# Altium project BLDC MOTOR CONTROLLER.PrjPcb
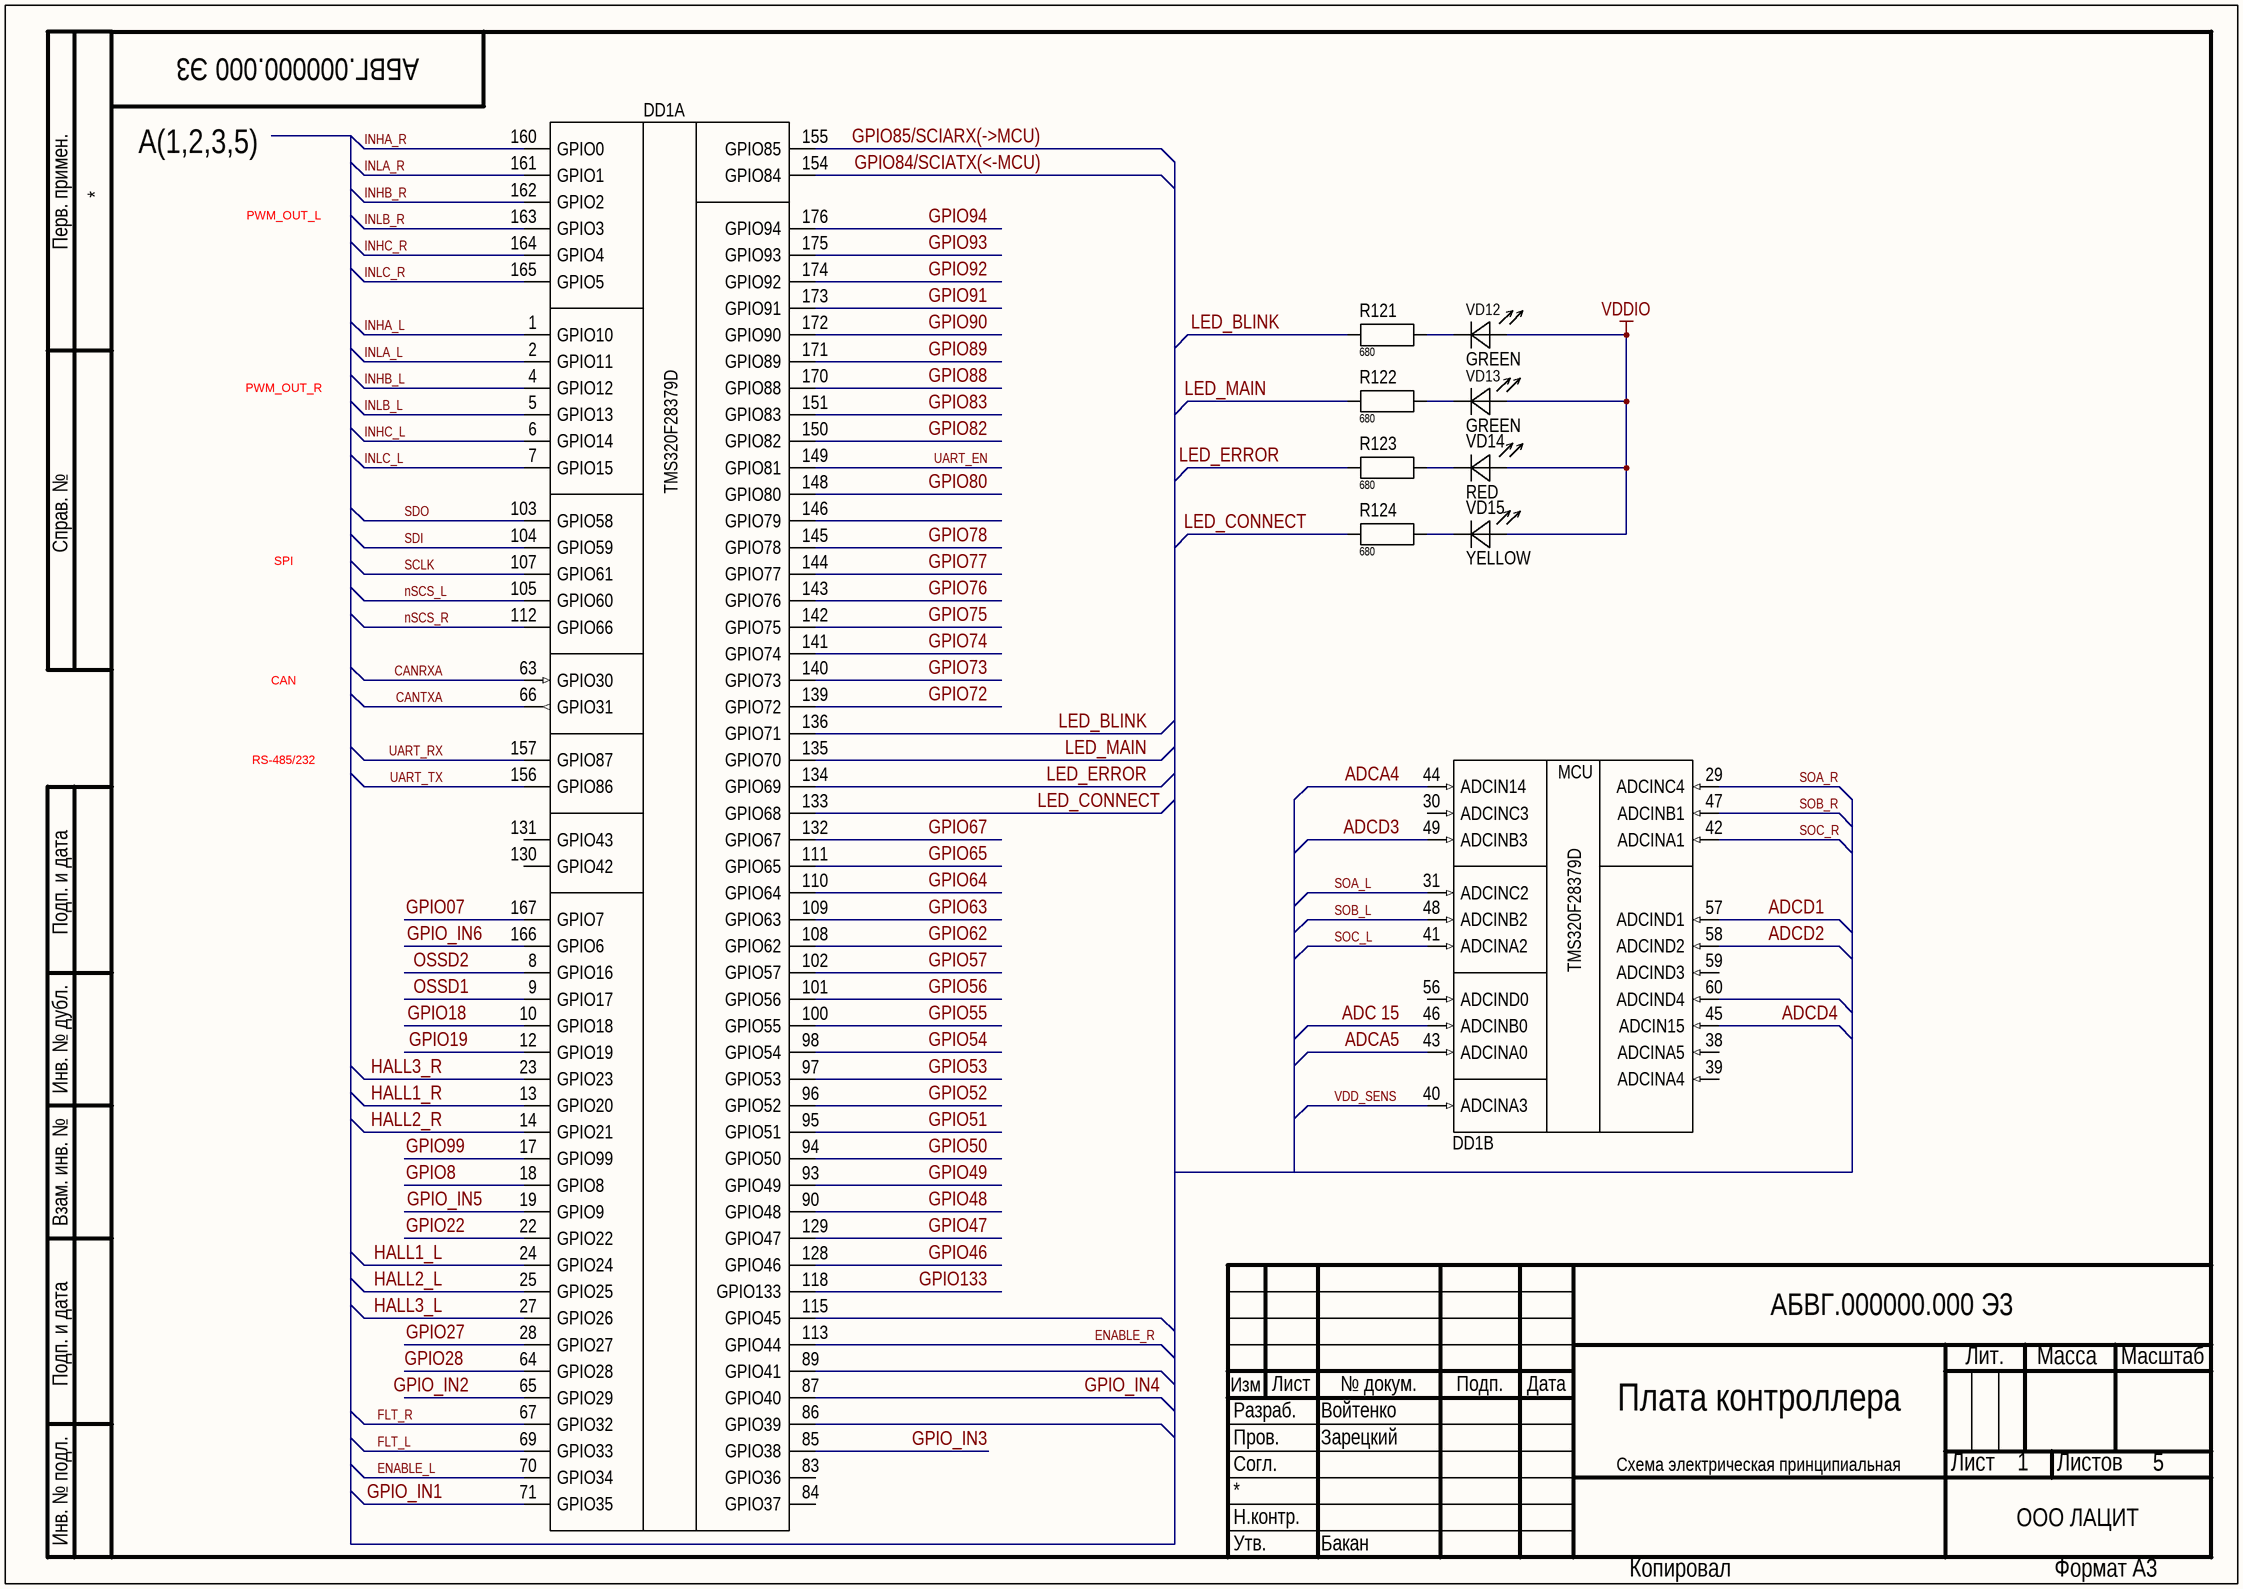
[diagram p0: BLDC-CONTROLLET.SchDoc]
6 sheets, 345 parts. Net scope: global (net labels, ports and power ports of the same name join across sheets).
Board file: BLDC MOTOR CONTROLLER.PcbDoc
Sheets:
  BLDC-CONTROLLET.SchDoc
  BLDC-DRIVER.SchDoc
  BLDC-MOSFET.SchDoc
  BLDC-PWR-CONROLLER.SchDoc
  BLDC-CONNECTORS.SchDoc
  BLDC-FTDI.SchDoc

## Sheet BLDC-CONTROLLET.SchDoc
size 420 x 297 mm; ApprovedBy: Бакан; CheckedBy: Зарецкий; DrawnBy: Войтенко; DocumentNumber: АБВГ.000000.000 Э3; SheetNumber: 1; SheetTotal: 5; PageSetup: Record=PageOptions|CenterHorizontal=False|CenterVertical=False|PrintScale=0.95|XCorrection=0.00|YCorrection=0.00|PrintKind=1|BorderSize=5000000|LeftOffset=0|BottomOffset=0|Orientation=1|PaperLength=1000|PaperWidth=1000|Scale=100|PaperSource=15|PrintQuality=600|MediaType=1|DitherType=10|PaperKind=A4|PrintScaleMode=1; DocumentType: Схема электрическая принципиальная; Developer1size1str: ООО ЛАЦИТ; Title1size1str: Плата контроллера

### Parts
DD1  TMS320F28379DPTP_LACID  [176-HLQFP]  (value not drawn)  (parts A,B of 3)
R121  680  [RES: 0402]
R122  680  [RES: 0402]
R123  680  [RES: 0402]
R124  680  [RES: 0402]
VD12  value GREEN  [LED: 0402G]  (hidden comment: Led 0402 GREEN)
VD13  value GREEN  [LED: 0402G]  (hidden comment: Led 0402 GREEN)
VD14  value RED  [LED: 0402R]  (hidden comment: Led 0402 RED)
VD15  value YELLOW  [LED: 0402Y]  (hidden comment: Led 0402 YELLOW)

### Nets
VDDIO: VD12.1 VD13.1 VD14.1 VD15.1
ADC 15: DD1.46(ADCINB0)
ADCA4: DD1.44(ADCIN14)
ADCA5: DD1.43(ADCINA0)
ADCD1: DD1.57(ADCIND1)
ADCD2: DD1.58(ADCIND2)
ADCD3: DD1.49(ADCINB3)
ADCD4: DD1.45(ADCIN15)
CANRXA: DD1.63(GPIO30)
CANTXA: DD1.66(GPIO31)
ENABLE_L: DD1.70(GPIO34)
ENABLE_R: DD1.113(GPIO44)
FLT_L: DD1.69(GPIO33)
FLT_R: DD1.67(GPIO32)
GPIO07: DD1.167(GPIO7)
GPIO8: DD1.18(GPIO8)
GPIO18: DD1.10(GPIO18)
GPIO19: DD1.12(GPIO19)
GPIO22: DD1.22(GPIO22)
GPIO27: DD1.28(GPIO27)
GPIO28: DD1.64(GPIO28)
GPIO46: DD1.128(GPIO46)
GPIO47: DD1.129(GPIO47)
GPIO48: DD1.90(GPIO48)
GPIO49: DD1.93(GPIO49)
GPIO50: DD1.94(GPIO50)
GPIO51: DD1.95(GPIO51)
GPIO52: DD1.96(GPIO52)
GPIO53: DD1.97(GPIO53)
GPIO54: DD1.98(GPIO54)
GPIO55: DD1.100(GPIO55)
GPIO56: DD1.101(GPIO56)
GPIO57: DD1.102(GPIO57)
GPIO62: DD1.108(GPIO62)
GPIO63: DD1.109(GPIO63)
GPIO64: DD1.110(GPIO64)
GPIO65: DD1.111(GPIO65)
GPIO67: DD1.132(GPIO67)
GPIO72: DD1.139(GPIO72)
GPIO73: DD1.140(GPIO73)
GPIO74: DD1.141(GPIO74)
GPIO75: DD1.142(GPIO75)
GPIO76: DD1.143(GPIO76)
GPIO77: DD1.144(GPIO77)
GPIO78: DD1.145(GPIO78)
GPIO80: DD1.148(GPIO80)
GPIO82: DD1.150(GPIO82)
GPIO83: DD1.151(GPIO83)
GPIO84/SCIATX(<-MCU): DD1.154(GPIO84)
GPIO85/SCIARX(->MCU): DD1.155(GPIO85)
GPIO88: DD1.170(GPIO88)
GPIO89: DD1.171(GPIO89)
GPIO90: DD1.172(GPIO90)
GPIO91: DD1.173(GPIO91)
GPIO92: DD1.174(GPIO92)
GPIO93: DD1.175(GPIO93)
GPIO94: DD1.176(GPIO94)
GPIO99: DD1.17(GPIO99)
GPIO133: DD1.118(GPIO133)
GPIO_IN1: DD1.71(GPIO35)
GPIO_IN2: DD1.65(GPIO29)
GPIO_IN3: DD1.85(GPIO38)
GPIO_IN4: DD1.87(GPIO40)
GPIO_IN5: DD1.19(GPIO9)
GPIO_IN6: DD1.166(GPIO6)
HALL1_L: DD1.24(GPIO24)
HALL1_R: DD1.13(GPIO20)
HALL2_L: DD1.25(GPIO25)
HALL2_R: DD1.14(GPIO21)
HALL3_L: DD1.27(GPIO26)
HALL3_R: DD1.23(GPIO23)
INHA_L: DD1.1(GPIO10)
INHA_R: DD1.160(GPIO0)
INHB_L: DD1.4(GPIO12)
INHB_R: DD1.162(GPIO2)
INHC_L: DD1.6(GPIO14)
INHC_R: DD1.164(GPIO4)
INLA_L: DD1.2(GPIO11)
INLA_R: DD1.161(GPIO1)
INLB_L: DD1.5(GPIO13)
INLB_R: DD1.163(GPIO3)
INLC_L: DD1.7(GPIO15)
INLC_R: DD1.165(GPIO5)
LED_BLINK: DD1.136(GPIO71) R121.1
LED_CONNECT: DD1.133(GPIO68) R124.1
LED_ERROR: DD1.134(GPIO69) R123.1
LED_MAIN: DD1.135(GPIO70) R122.1
nSCS_L: DD1.105(GPIO60)
nSCS_R: DD1.112(GPIO66)
OSSD1: DD1.9(GPIO17)
OSSD2: DD1.8(GPIO16)
SCLK: DD1.107(GPIO61)
SDI: DD1.104(GPIO59)
SDO: DD1.103(GPIO58)
SOA_L: DD1.31(ADCINС2)
SOA_R: DD1.29(ADCINC4)
SOB_L: DD1.48(ADCINB2)
SOB_R: DD1.47(ADCINB1)
SOC_L: DD1.41(ADCINA2)
SOC_R: DD1.42(ADCINA1)
UART_EN: DD1.149(GPIO81)
UART_RX: DD1.157(GPIO87)
UART_TX: DD1.156(GPIO86)
VDD_SENS: DD1.40(ADCINA3)
NetR121_2: R121.2 VD12.2
NetR122_2: R122.2 VD13.2
NetR123_2: R123.2 VD14.2
NetR124_2: R124.2 VD15.2

Not connected (* = marked no-connect by the designer): DD1 30(ADCINC3) 38(ADCINA5) 39(ADCINA4) 56(ADCIND0) 59(ADCIND3) 60(ADCIND4) 83(GPIO36) 84(GPIO37) 86(GPIO39) 89(GPIO41) 115(GPIO45) 130(GPIO42) 131(GPIO43) 146(GPIO79)

### Notes on the sheet
- А(1,2,3,5)
- PWM_OUT_L
- PWM_OUT_R
- SPI
- CAN
- RS-485/232
- Перв. примен.
- Справ. №
- Подп. и дата
- Инв. № дубл.
- Взам. инв. №
- Изм
- Лист
- № докум.
- Подп.
- Дата
- Лит.
- Масса
- Масштаб
- Пров.
- Согл.
- Разраб.
- Листов
- Инв. № подл.
- Н.контр.
- Утв.
- Копировал
- Формат А3
- (in symbol TMS320F28379DPTP_LACID, part A) TMS320F28379D
- (in symbol TMS320F28379DPTP_LACID, part B) MCU; TMS320F28379D

### Library data of the parts
DD1 = TMS320F28379DPTP_LACID: PartNumber: TMS320F28379DPTPT; Case: HLQFP-176
R121-R124 = RES 0402: PartNumber: RC0402FR-07680RL; Value: 680; Case: 0402

## Sheet BLDC-DRIVER.SchDoc
size 420 x 297 mm; DocumentNumber: АБВГ.000000.000 Э3; SheetNumber: 2; PageSetup: Record=PageOptions|CenterHorizontal=False|CenterVertical=False|PrintScale=0.95|XCorrection=0.00|YCorrection=0.00|PrintKind=1|BorderSize=5000000|LeftOffset=0|BottomOffset=0|Orientation=1|PaperLength=1000|PaperWidth=1000|Scale=100|PaperSource=15|PrintQuality=600|MediaType=1|DitherType=10|PaperKind=A4|PrintScaleMode=1; Letter1Column: {}; Letter2Column: {}; Letter3Column: {}; ProcessInspection: ProcessInspection; EngineerName: EngineerName; NormInspection: NormInspection; DocumentType: DocumentType; Mass: Mass; Scale: Scale; Developer1size1str: Developer1size1str; Developer2size1str: Developer2size1str; Developer2size2str: Developer2size2str; Title1size1str: Title1size1str; Title2size1str: Title2size1str; Title2size2str: Title2size2str; Title3size3str: Title3size3str; Title3size2str: Title3size2str; Title3size1str: Title3size1str; FunctionalGroup: #_
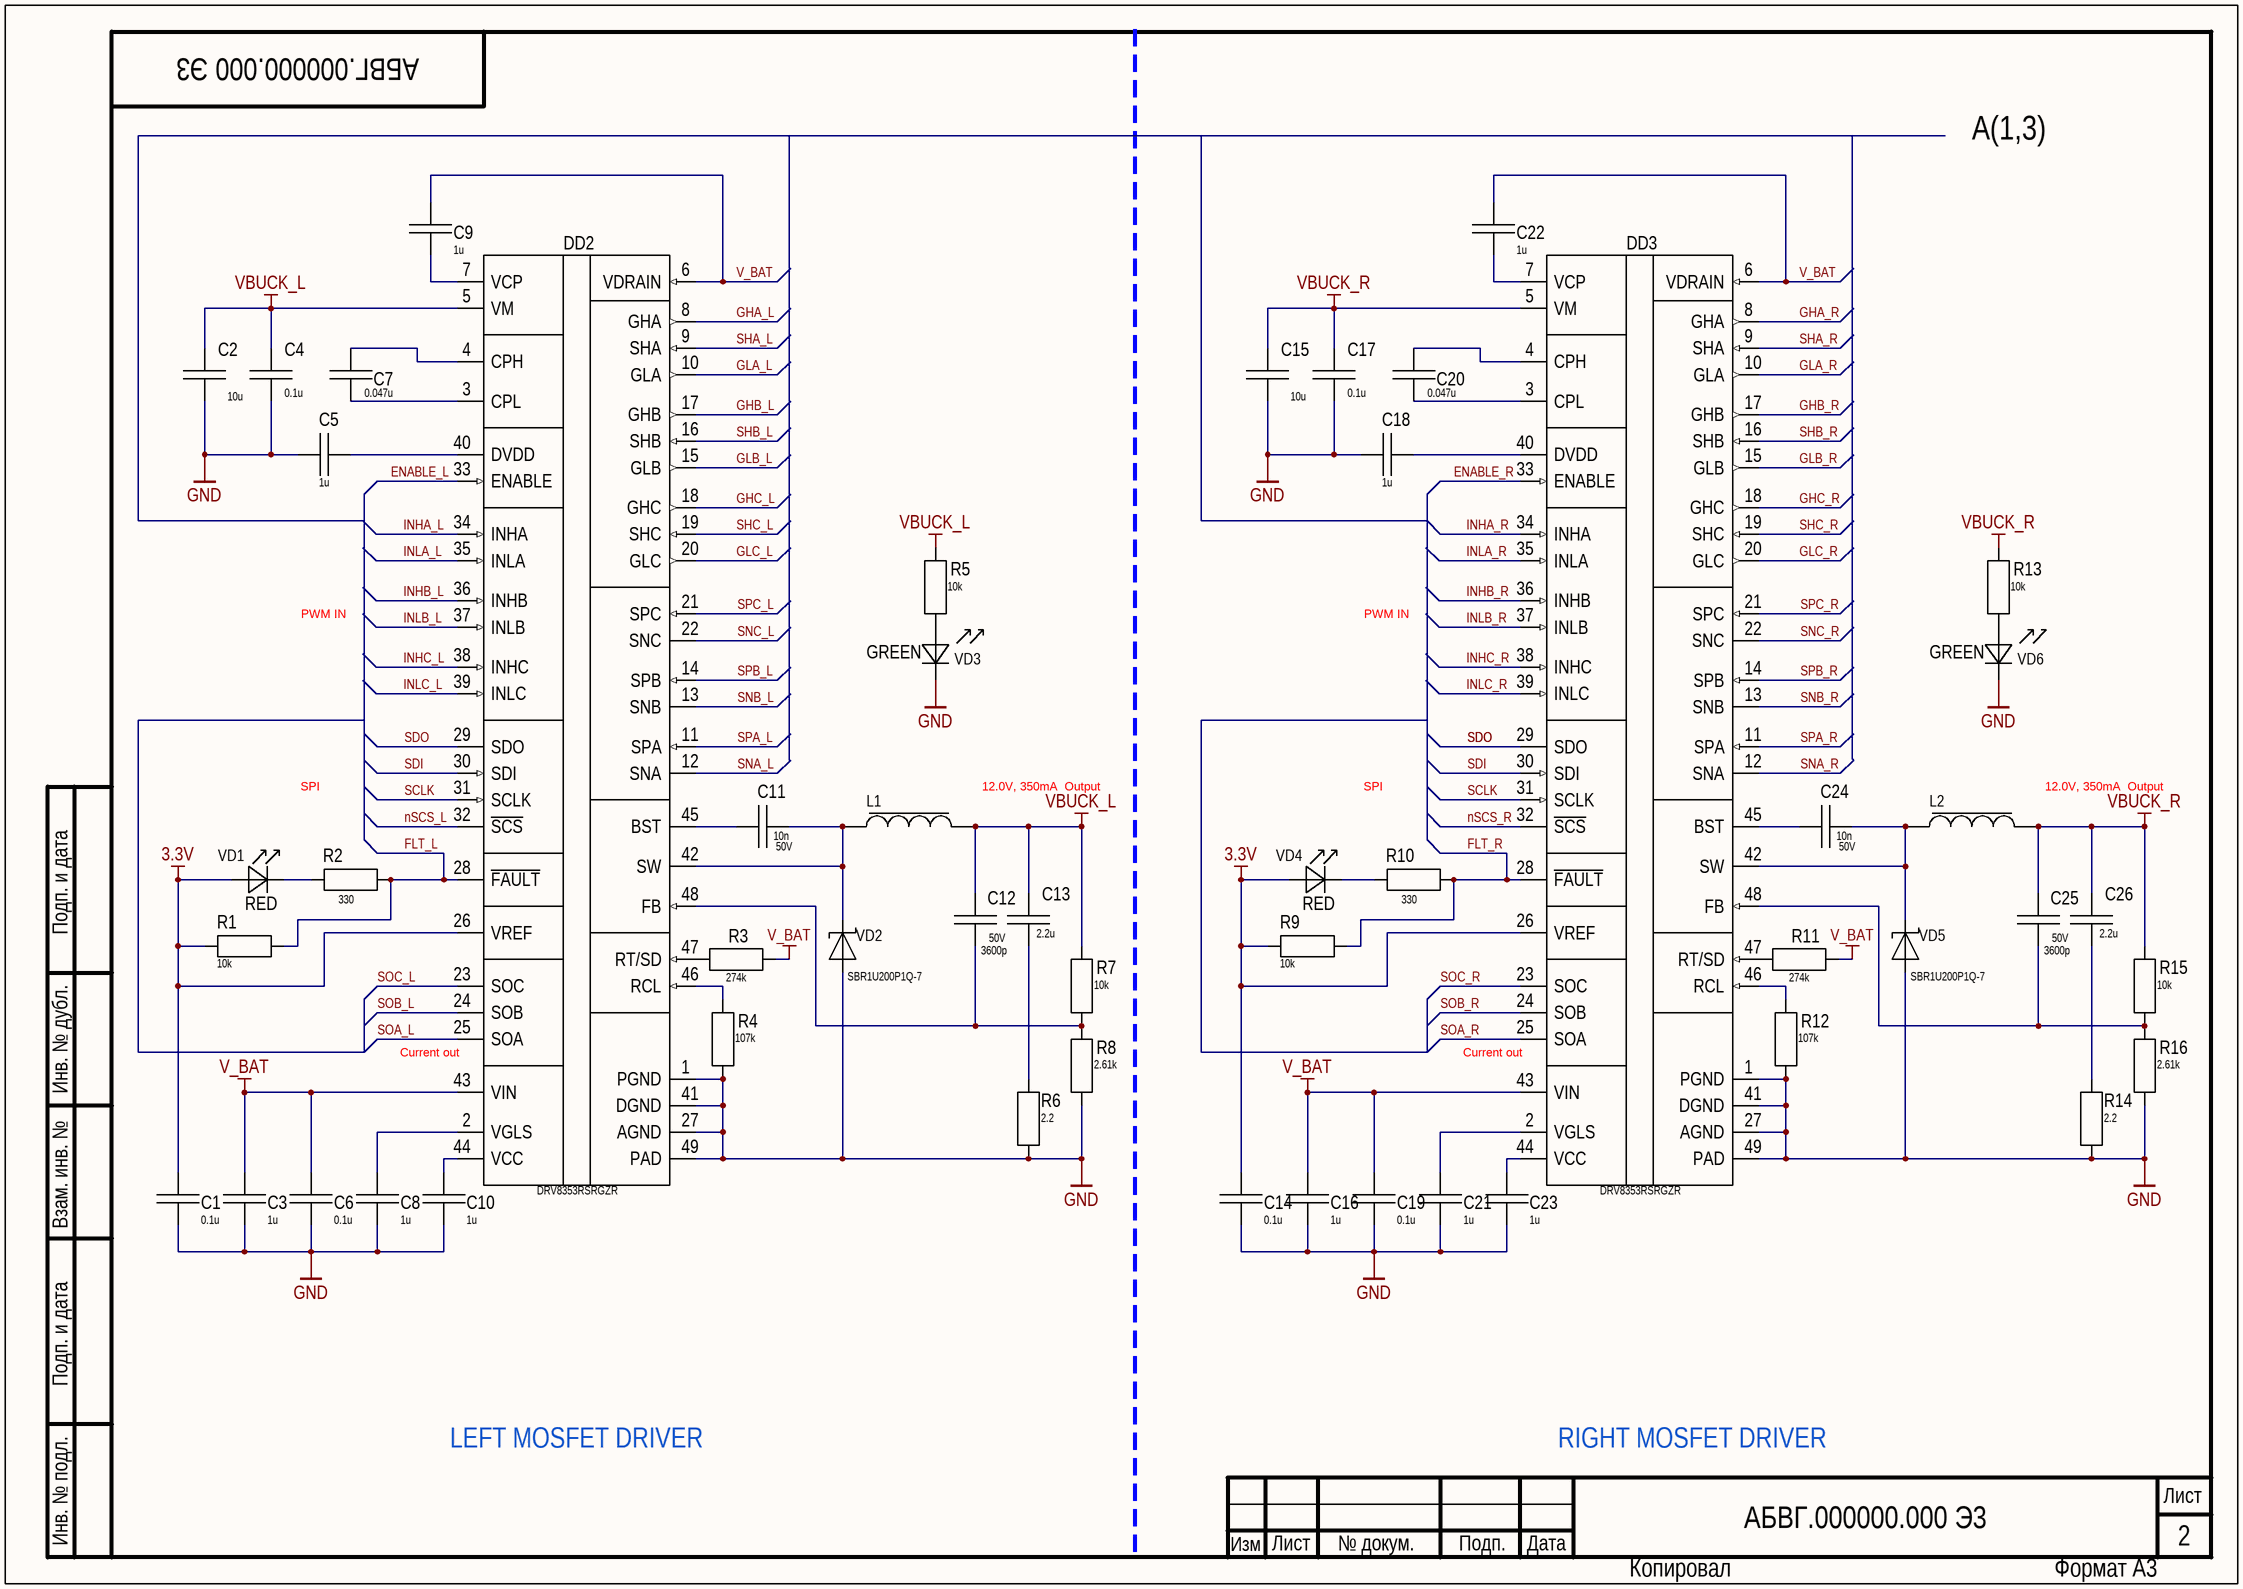
[diagram p1: BLDC-DRIVER.SchDoc]

### Parts
C1  0.1u  [CAP: 0402]
C2  10u  [CAP: 2220]
C3  1u  [CAP: 1206]
C4  0.1u  [CAP: 0805]
C5  1u  [CAP: 0603]
C6  0.1u  [CAP: 0805]
C7  0.047u  [CAP: 0805]
C8  1u  [CAP: 0603]
C9  1u  [CAP: 1206]
C10  1u  [CAP: 0603]
C11  Voltage: 50V  [CAP: 0402]  (hidden comment: 10n)
C12  Voltage: 50V  [CAP: 0402]  (hidden comment: 3600p)
C13  2.2u  [CAP: 0603]
C14  0.1u  [CAP: 0402]
C15  10u  [CAP: 2220]
C16  1u  [CAP: 1206]
C17  0.1u  [CAP: 0805]
C18  1u  [CAP: 0603]
C19  0.1u  [CAP: 0805]
C20  0.047u  [CAP: 0805]
C21  1u  [CAP: 0603]
C22  1u  [CAP: 1206]
C23  1u  [CAP: 0603]
C24  Voltage: 50V  [CAP: 0402]  (hidden comment: 10n)
C25  Voltage: 50V  [CAP: 0402]  (hidden comment: 3600p)
C26  2.2u  [CAP: 0603]
DD2  DRV8353RSRGZR  [48-VQFN]
DD3  DRV8353RSRGZR  [48-VQFN]
L1  (no value)  [IND: 2525]
L2  (no value)  [IND: 2525]
R1  10k  [RES: 0402]
R2  330  [RES: 0402]
R3  274k  [RES: 0402]
R4  107k  [RES: 0402]
R5  10k  [RES: 0402]
R6  2.2  [RES: 0603]
R7  10k  [RES: 0402]
R8  2.61k  [RES: 0402]
R9  10k  [RES: 0402]
R10  330  [RES: 0402]
R11  274k  [RES: 0402]
R12  107k  [RES: 0402]
R13  10k  [RES: 0402]
R14  2.2  [RES: 0603]
R15  10k  [RES: 0402]
R16  2.61k  [RES: 0402]
VD1  value RED  [LED: 0402R]  (hidden comment: Led 0402 RED)
VD2  PartNumber: SBR1U200P1Q-7  [DIODE: PowerDI 123]
VD3  value GREEN  [LED: 0402G]  (hidden comment: Led 0402 GREEN)
VD4  value RED  [LED: 0402R]  (hidden comment: Led 0402 RED)
VD5  PartNumber: SBR1U200P1Q-7  [DIODE: PowerDI 123]
VD6  value GREEN  [LED: 0402G]  (hidden comment: Led 0402 GREEN)

### Nets
3.3V: C1.1 C14.1 DD2.26(VREF) DD3.26(VREF) R1.2 R9.2 VD1.1 VD4.1
GND: C1.2 C2.1 C3.1 C4.1 C5.2 C6.1 C8.1 C10.1 C14.2 C15.1 C16.1 C17.1 C18.2 C19.1 C21.1 C23.1 DD2.1(PGND) DD2.27(AGND) DD2.41(DGND) DD2.49(PAD) DD3.1(PGND) DD3.27(AGND) DD3.41(DGND) DD3.49(PAD) R4.1 R6.1 R8.1 R12.1 R14.1 R16.1 VD2.1 VD3.2 VD5.1 VD6.2
V_BAT: C3.2 C6.2 C9.2 C16.2 C19.2 C22.2 DD2.6(VDRAIN) DD2.43(VIN) DD3.6(VDRAIN) DD3.43(VIN) R3.1 R11.1
VBUCK_L: C2.2 C4.2 C12.2 C13.2 DD2.5(VM) L1.1 R5.2 R7.2
VBUCK_R: C15.2 C17.2 C25.2 C26.2 DD3.5(VM) L2.1 R13.2 R15.2
ENABLE_L: DD2.33(ENABLE)
ENABLE_R: DD3.33(ENABLE)
FLT_L: DD2.28(~{FAULT}) R1.1 R2.1
FLT_R: DD3.28(~{FAULT}) R9.1 R10.1
GHA_L: DD2.8(GHA)
GHA_R: DD3.8(GHA)
GHB_L: DD2.17(GHB)
GHB_R: DD3.17(GHB)
GHC_L: DD2.18(GHC)
GHC_R: DD3.18(GHC)
GLA_L: DD2.10(GLA)
GLA_R: DD3.10(GLA)
GLB_L: DD2.15(GLB)
GLB_R: DD3.15(GLB)
GLC_L: DD2.20(GLC)
GLC_R: DD3.20(GLC)
INHA_L: DD2.34(INHA)
INHA_R: DD3.34(INHA)
INHB_L: DD2.36(INHB)
INHB_R: DD3.36(INHB)
INHC_L: DD2.38(INHC)
INHC_R: DD3.38(INHC)
INLA_L: DD2.35(INLA)
INLA_R: DD3.35(INLA)
INLB_L: DD2.37(INLB)
INLB_R: DD3.37(INLB)
INLC_L: DD2.39(INLC)
INLC_R: DD3.39(INLC)
nSCS_L: DD2.32(~{SCS})
nSCS_R: DD3.32(~{SCS})
SCLK: DD2.31(SCLK) DD3.31(SCLK)
SDI: DD2.30(SDI) DD3.30(SDI)
SDO: DD2.29(SDO) DD3.29(SDO)
SHA_L: DD2.9(SHA)  [project net OUTA_L]
SHA_R: DD3.9(SHA)  [project net OUTA_R]
SHB_L: DD2.16(SHB)  [project net OUTB_L]
SHB_R: DD3.16(SHB)  [project net OUTB_R]
SHC_L: DD2.19(SHC)  [project net OUTC_L]
SHC_R: DD3.19(SHC)  [project net OUTC_R]
SNA_L: DD2.12(SNA)
SNA_R: DD3.12(SNA)
SNB_L: DD2.13(SNB)
SNB_R: DD3.13(SNB)
SNC_L: DD2.22(SNC)
SNC_R: DD3.22(SNC)
SOA_L: DD2.25(SOA)
SOA_R: DD3.25(SOA)
SOB_L: DD2.24(SOB)
SOB_R: DD3.24(SOB)
SOC_L: DD2.23(SOC)
SOC_R: DD3.23(SOC)
SPA_L: DD2.11(SPA)
SPA_R: DD3.11(SPA)
SPB_L: DD2.14(SPB)
SPB_R: DD3.14(SPB)
SPC_L: DD2.21(SPC)
SPC_R: DD3.21(SPC)
NetC5_1: C5.1 DD2.40(DVDD)
NetC7_1: C7.1 DD2.3(CPL)
NetC7_2: C7.2 DD2.4(CPH)
NetC8_2: C8.2 DD2.2(VGLS)
NetC9_1: C9.1 DD2.7(VCP)
NetC10_2: C10.2 DD2.44(VCC)
NetC11_1: C11.1 DD2.45(BST)
NetC11_2: C11.2 DD2.42(SW) L1.2 VD2.2
NetC12_1: C12.1 DD2.48(FB) R7.1 R8.2
NetC13_1: C13.1 R6.2
NetC18_1: C18.1 DD3.40(DVDD)
NetC20_1: C20.1 DD3.3(CPL)
NetC20_2: C20.2 DD3.4(CPH)
NetC21_2: C21.2 DD3.2(VGLS)
NetC22_1: C22.1 DD3.7(VCP)
NetC23_2: C23.2 DD3.44(VCC)
NetC24_1: C24.1 DD3.45(BST)
NetC24_2: C24.2 DD3.42(SW) L2.2 VD5.2
NetC25_1: C25.1 DD3.48(FB) R15.1 R16.2
NetC26_1: C26.1 R14.2
NetDD2_46: DD2.46(RCL) R4.2
NetDD2_47: DD2.47(RT/SD) R3.2
NetDD3_46: DD3.46(RCL) R12.2
NetDD3_47: DD3.47(RT/SD) R11.2
NetR2_2: R2.2 VD1.2
NetR5_1: R5.1 VD3.1
NetR10_2: R10.2 VD4.2
NetR13_1: R13.1 VD6.1

### Notes on the sheet
- А(1,3)
- PWM IN
- SPI
- (near L1) 12.0V, 350mA  Output
- (near L2) 12.0V, 350mA  Output
- (near DD2) Current out
- (near DD3) Current out
- LEFT MOSFET DRIVER
- RIGHT MOSFET DRIVER
- Подп. и дата
- Инв. № дубл.
- Взам. инв. №
- Инв. № подл.
- Лист
- Изм
- № докум.
- Подп.
- Дата
- Копировал
- Формат А3

### Library data of the parts
C1 C14 = CAP 0402: PartNumber: C0402C104K8PAC; Manufacturer: Kemet; Voltage: 10V; Type: Capacitor; Temperature_Range: -55/+85; Tolerance: 10%; Value: 0.1u; Case: 0402
C2 C15 = CAP 2220: PartNumber: CGA9N3X7S2A106K230KE; Voltage: 100V; Tolerance: 10%; Case: 1812; Value: 10u
C3 C9 C16 C22 = CAP 1206: Voltage: 100V; Tolerance: 10%; PartNumber: *; Case: 1206; Value: 1u
C4 C6 C7 C17 C19 C20 = CAP 0805: Voltage: 100V; Tolerance: 10%; PartNumber: *; Case: 0805
  C4 C6 C17 C19: Value: 0.1u
  C7 C20: Value: 0.047u
C5 C8 C10 C18 C21 C23 = CAP 0603: Voltage: 16V; Tolerance: 10%; PartNumber: *; Case: 0603; ComponentLink1Description: Mouser; ComponentLink1URL: *; Value: 1u
C11 C24 = CAP 0402: Tolerance: 10%; PartNumber: *; Case: 0402; Value: 10n
C12 C25 = CAP 0402: Tolerance: 5%; PartNumber: *; Case: 0402; Value: 3600p
C13 C26 = CAP 0603: Voltage: 35V; Tolerance: 10%; PartNumber: *; Case: 0603; ComponentLink1Description: Mouser; ComponentLink1URL: *; Value: 2.2u
L1 L2 = Inductor_2525: TypeInductor: Fixed inductor; Temperature: -40...+150°C
R1-R5 R7-R13 R15 R16 = RES 0402: Tolerance: 1%; PartNumber: *
  R1 R5 R7 R9 R13 R15: Value: 10k
  R2 R10: Value: 330
  R3 R11: Value: 274k
  R4 R12: Value: 107k
  R8 R16: Value: 2.61k
R6 R14 = RES 0603: Tolerance: 1%; PartNumber: *; Value: 2.2
VD2 VD5 = Schottky_single: Manufacturer: Diodes Incorporated; ValueManufacturerPartNumber: Schottky diode, 200V, 1A, 850mV, 15pF, PowerDI-123-2, -55...+150°C; TypeDiode: Schottky diode; Voltage: 200V; Current: 1A; VoltageDrop: 850mV; RecoveryTime: 15pF; Package: PowerDI-123-2; HelpURL: https://www.digikey.com/product-detail/en/diodes-incorporated/MBR0580S1-7/MBR0580S1-7DICT-ND/5080371; Temperature: -55...+150°C

## Sheet BLDC-MOSFET.SchDoc
size 420 x 297 mm; ApprovedBy: Алымов; CheckedBy: Лучников; DrawnBy: Войтенко; DocumentNumber: АБВГ.000000.000 Э3; SheetNumber: 3; SheetTotal: 5; PageSetup: Record=PageOptions|CenterHorizontal=False|CenterVertical=False|PrintScale=0.95|XCorrection=0.00|YCorrection=0.00|PrintKind=1|BorderSize=5000000|LeftOffset=0|BottomOffset=0|Orientation=1|PaperLength=1000|PaperWidth=1000|Scale=100|PaperSource=15|PrintQuality=600|MediaType=1|DitherType=10|PaperKind=A4|PrintScaleMode=1; Letter1Column: Т; ProcessInspection: Близнец; NormInspection: Оськин; DocumentType: Схема электрическая принципиальная; Developer1size1str: ООО "Центр2М"; Title2size1str: Модуль питания; Title2size2str: основная плата
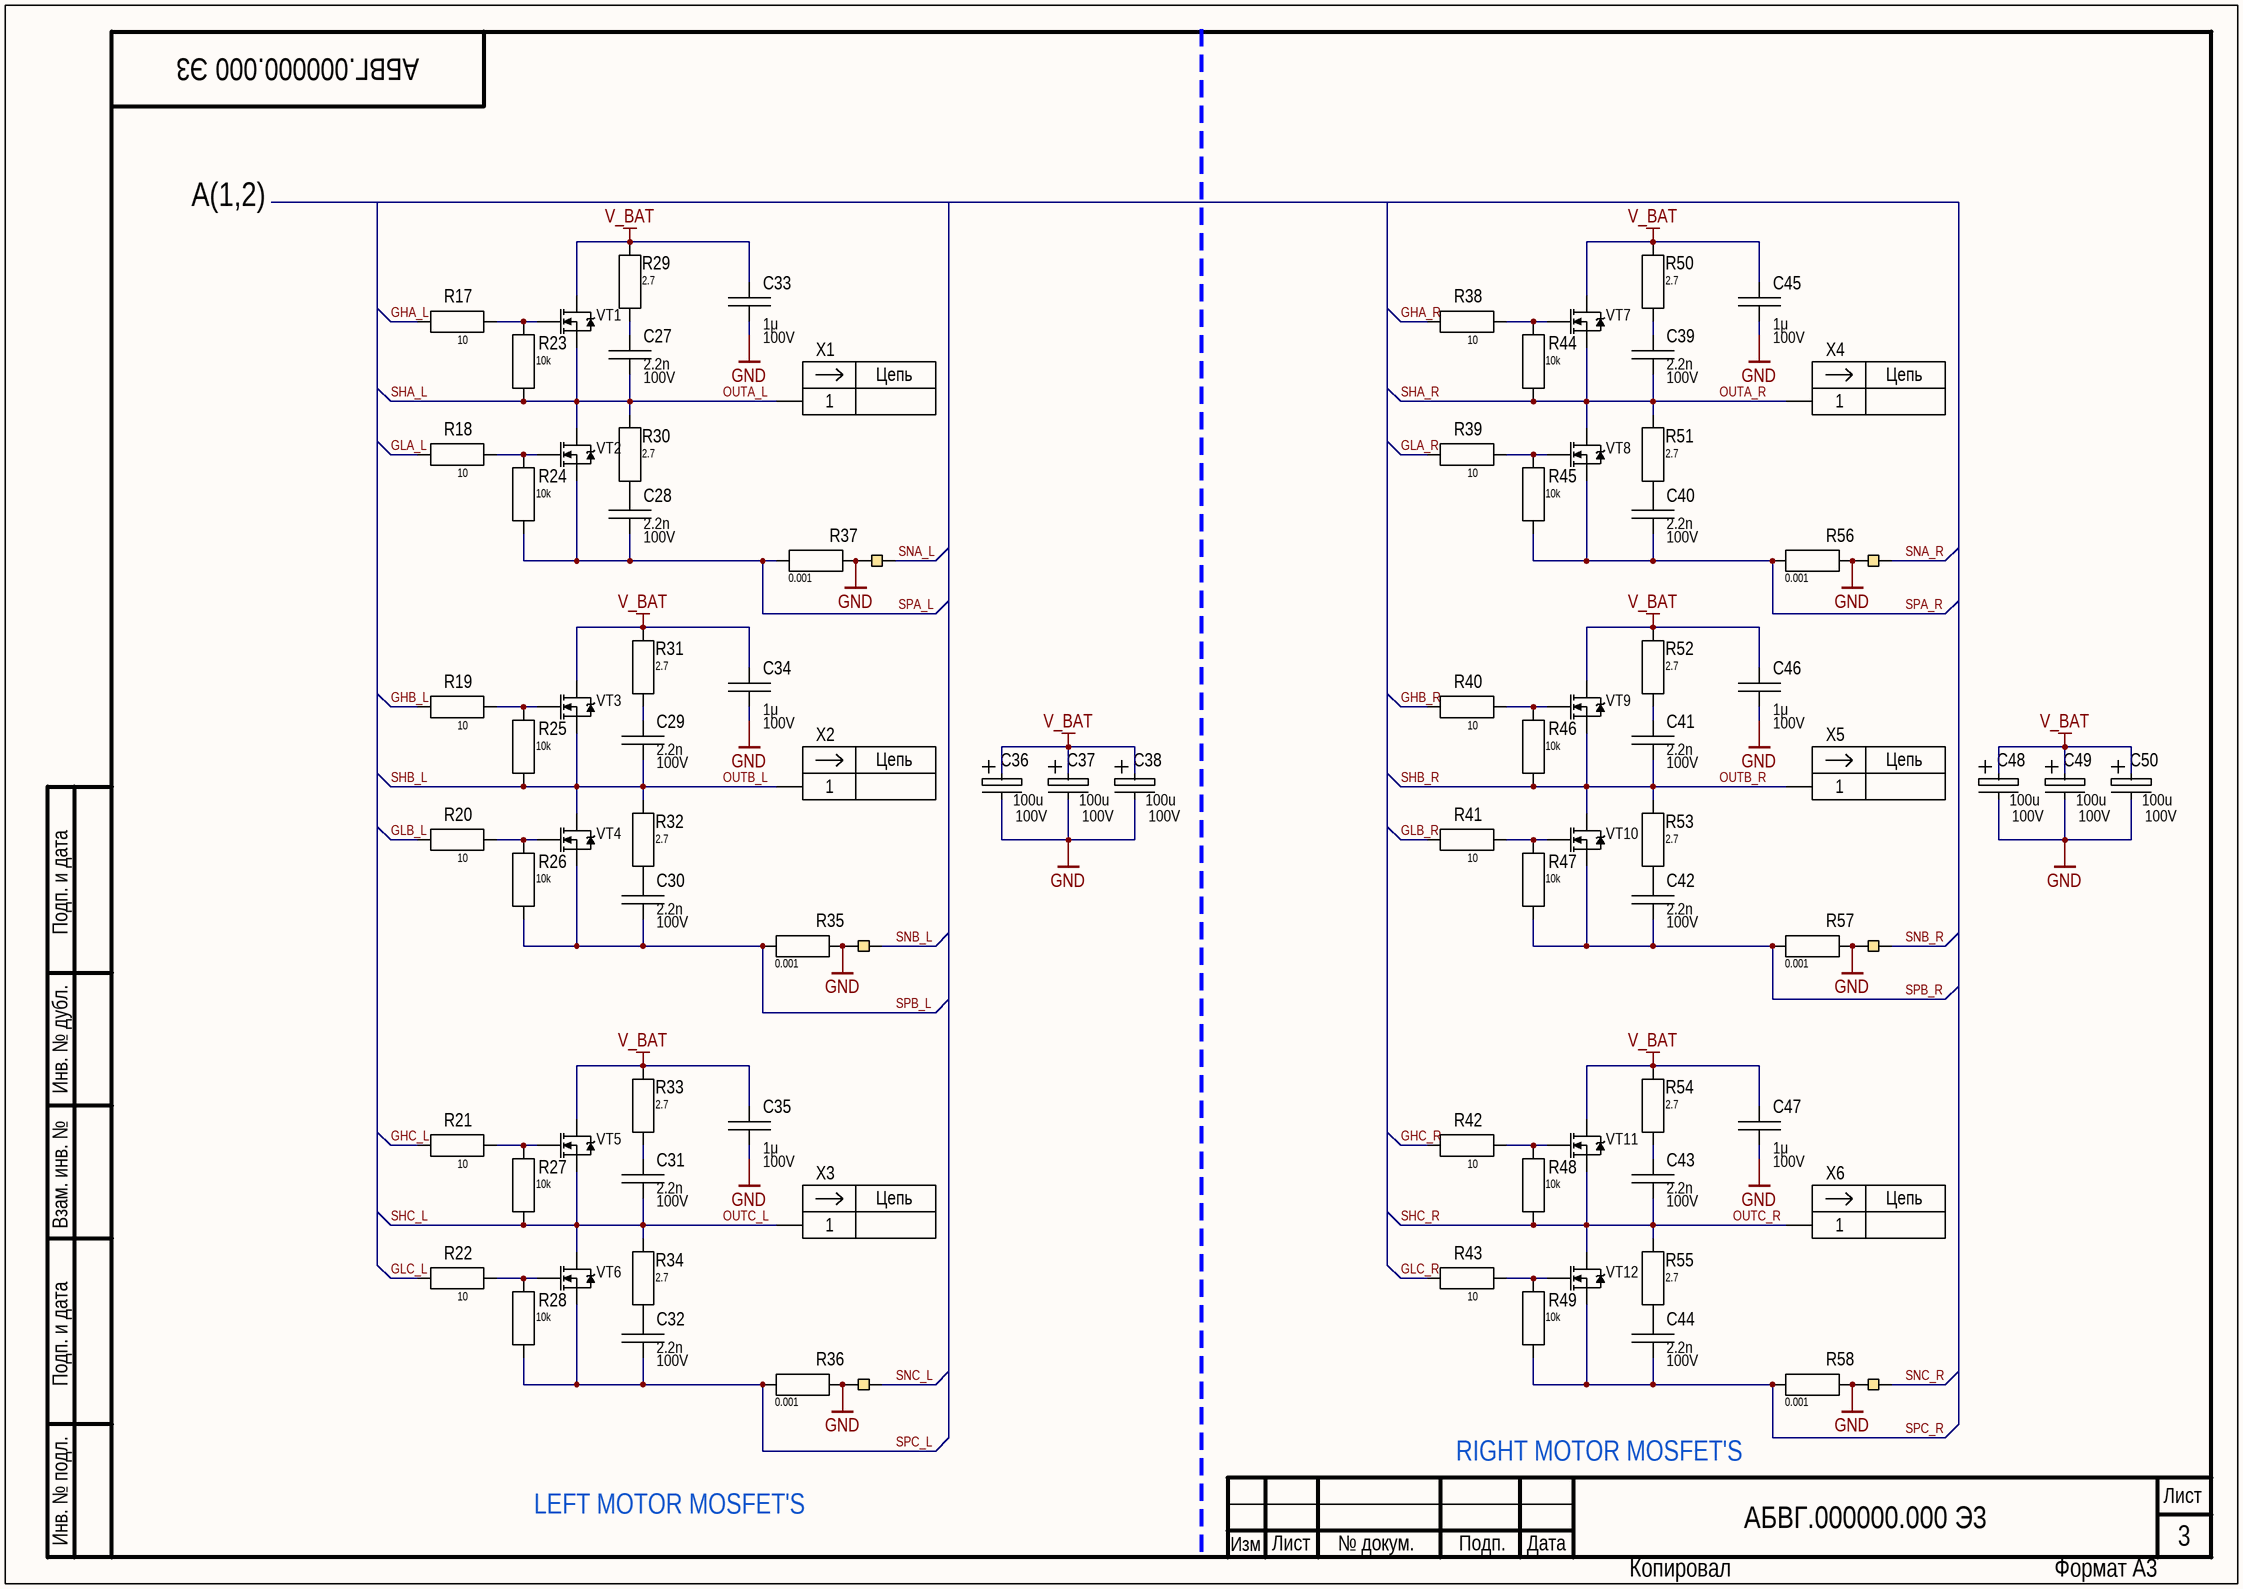
[diagram p2: BLDC-MOSFET.SchDoc]

### Parts
C27  value 2.2n  Voltage: 100V  [CAP: 0603]
C28  value 2.2n  Voltage: 100V  [CAP: 0603]
C29  value 2.2n  Voltage: 100V  [CAP: 0603]
C30  value 2.2n  Voltage: 100V  [CAP: 0603]
C31  value 2.2n  Voltage: 100V  [CAP: 0603]
C32  value 2.2n  Voltage: 100V  [CAP: 0603]
C33  value 1μ  Voltage: 100V  [CAP: 1206]
C34  value 1μ  Voltage: 100V  [CAP: 1206]
C35  value 1μ  Voltage: 100V  [CAP: 1206]
C36  Voltage: 100V  [ECR1021]  (hidden comment: 100u)
C37  Voltage: 100V  [ECR1021]  (hidden comment: 100u)
C38  Voltage: 100V  [ECR1021]  (hidden comment: 100u)
C39  value 2.2n  Voltage: 100V  [CAP: 0603]
C40  value 2.2n  Voltage: 100V  [CAP: 0603]
C41  value 2.2n  Voltage: 100V  [CAP: 0603]
C42  value 2.2n  Voltage: 100V  [CAP: 0603]
C43  value 2.2n  Voltage: 100V  [CAP: 0603]
C44  value 2.2n  Voltage: 100V  [CAP: 0603]
C45  value 1μ  Voltage: 100V  [CAP: 1206]
C46  value 1μ  Voltage: 100V  [CAP: 1206]
C47  value 1μ  Voltage: 100V  [CAP: 1206]
C48  Voltage: 100V  [ECR1021]  (hidden comment: 100u)
C49  Voltage: 100V  [ECR1021]  (hidden comment: 100u)
C50  Voltage: 100V  [ECR1021]  (hidden comment: 100u)
NT1  (no value)  [CON: NT]
NT2  (no value)  [CON: NT]
NT3  (no value)  [CON: NT]
NT4  (no value)  [CON: NT]
NT5  (no value)  [CON: NT]
NT6  (no value)  [CON: NT]
R17  10  [RES: 0402]
R18  10  [RES: 0402]
R19  10  [RES: 0402]
R20  10  [RES: 0402]
R21  10  [RES: 0402]
R22  10  [RES: 0402]
R23  10k  [RES: 0402]
R24  10k  [RES: 0402]
R25  10k  [RES: 0402]
R26  10k  [RES: 0402]
R27  10k  [RES: 0402]
R28  10k  [RES: 0402]
R29  2.7  [RES: 0805]
R30  2.7  [RES: 0805]
R31  2.7  [RES: 0805]
R32  2.7  [RES: 0805]
R33  2.7  [RES: 0805]
R34  2.7  [RES: 0805]
R35  0.001  [RES: 2512]
R36  0.001  [RES: 2512]
R37  0.001  [RES: 2512]
R38  10  [RES: 0402]
R39  10  [RES: 0402]
R40  10  [RES: 0402]
R41  10  [RES: 0402]
R42  10  [RES: 0402]
R43  10  [RES: 0402]
R44  10k  [RES: 0402]
R45  10k  [RES: 0402]
R46  10k  [RES: 0402]
R47  10k  [RES: 0402]
R48  10k  [RES: 0402]
R49  10k  [RES: 0402]
R50  2.7  [RES: 0805]
R51  2.7  [RES: 0805]
R52  2.7  [RES: 0805]
R53  2.7  [RES: 0805]
R54  2.7  [RES: 0805]
R55  2.7  [RES: 0805]
R56  0.001  [RES: 2512]
R57  0.001  [RES: 2512]
R58  0.001  [RES: 2512]
VT1  (no value)  [DirectFET MZ]
VT2  (no value)  [DirectFET MZ]
VT3  (no value)  [DirectFET MZ]
VT4  (no value)  [DirectFET MZ]
VT5  (no value)  [DirectFET MZ]
VT6  (no value)  [DirectFET MZ]
VT7  (no value)  [DirectFET MZ]
VT8  (no value)  [DirectFET MZ]
VT9  (no value)  [DirectFET MZ]
VT10  (no value)  [DirectFET MZ]
VT11  (no value)  [DirectFET MZ]
VT12  (no value)  [DirectFET MZ]
X1  DJ617-6.3 (TA-MR1)  [CON: DJ617-6.3 (TA-MR1)]  (value not drawn)
X2  DJ617-6.3 (TA-MR1)  [CON: DJ617-6.3 (TA-MR1)]  (value not drawn)
X3  DJ617-6.3 (TA-MR1)  [CON: DJ617-6.3 (TA-MR1)]  (value not drawn)
X4  DJ617-6.3 (TA-MR1)  [CON: DJ617-6.3 (TA-MR1)]  (value not drawn)
X5  DJ617-6.3 (TA-MR1)  [CON: DJ617-6.3 (TA-MR1)]  (value not drawn)
X6  DJ617-6.3 (TA-MR1)  [CON: DJ617-6.3 (TA-MR1)]  (value not drawn)

### Nets
GND: C33.1 C34.1 C35.1 C36.2 C37.2 C38.2 C45.1 C46.1 C47.1 C48.2 C49.2 C50.2 NT1.1 NT2.1 NT3.1 NT4.1 NT5.1 NT6.1 R35.1 R36.1 R37.1 R56.1 R57.1 R58.1
V_BAT: C33.2 C34.2 C35.2 C36.1 C37.1 C38.1 C45.2 C46.2 C47.2 C48.1 C49.1 C50.1 R29.2 R31.2 R33.2 R50.2 R52.2 R54.2 VT1.2(D) VT3.2(D) VT5.2(D) VT7.2(D) VT9.2(D) VT11.2(D)
GHA_L: R17.2
GHA_R: R38.2
GHB_L: R19.2
GHB_R: R40.2
GHC_L: R21.2
GHC_R: R42.2
GLA_L: R18.2
GLA_R: R39.2
GLB_L: R20.2
GLB_R: R41.2
GLC_L: R22.2
GLC_R: R43.2
OUTA_L: C27.1 R23.1 R30.2 VT1.3(S) VT2.2(D) X1.1  [also labelled SHA_L]
OUTA_R: C39.1 R44.1 R51.2 VT7.3(S) VT8.2(D) X4.1  [also labelled SHA_R]
OUTB_L: C29.1 R25.1 R32.2 VT3.3(S) VT4.2(D) X2.1  [also labelled SHB_L]
OUTB_R: C41.1 R46.1 R53.2 VT9.3(S) VT10.2(D) X5.1  [also labelled SHB_R]
OUTC_L: C31.1 R27.1 R34.2 VT5.3(S) VT6.2(D) X3.1  [also labelled SHC_L]
OUTC_R: C43.1 R48.1 R55.2 VT11.3(S) VT12.2(D) X6.1  [also labelled SHC_R]
SNA_L: NT3.2
SNA_R: NT4.2
SNB_L: NT1.2
SNB_R: NT5.2
SNC_L: NT2.2
SNC_R: NT6.2
SPA_L: C28.1 R24.1 R37.2 VT2.3(S)
SPA_R: C40.1 R45.1 R56.2 VT8.3(S)
SPB_L: C30.1 R26.1 R35.2 VT4.3(S)
SPB_R: C42.1 R47.1 R57.2 VT10.3(S)
SPC_L: C32.1 R28.1 R36.2 VT6.3(S)
SPC_R: C44.1 R49.1 R58.2 VT12.3(S)
NetC27_2: C27.2 R29.1
NetC28_2: C28.2 R30.1
NetC29_2: C29.2 R31.1
NetC30_2: C30.2 R32.1
NetC31_2: C31.2 R33.1
NetC32_2: C32.2 R34.1
NetC39_2: C39.2 R50.1
NetC40_2: C40.2 R51.1
NetC41_2: C41.2 R52.1
NetC42_2: C42.2 R53.1
NetC43_2: C43.2 R54.1
NetC44_2: C44.2 R55.1
NetR17_1: R17.1 R23.2 VT1.1(G)
NetR18_1: R18.1 R24.2 VT2.1(G)
NetR19_1: R19.1 R25.2 VT3.1(G)
NetR20_1: R20.1 R26.2 VT4.1(G)
NetR21_1: R21.1 R27.2 VT5.1(G)
NetR22_1: R22.1 R28.2 VT6.1(G)
NetR38_1: R38.1 R44.2 VT7.1(G)
NetR39_1: R39.1 R45.2 VT8.1(G)
NetR40_1: R40.1 R46.2 VT9.1(G)
NetR41_1: R41.1 R47.2 VT10.1(G)
NetR42_1: R42.1 R48.2 VT11.1(G)
NetR43_1: R43.1 R49.2 VT12.1(G)

### Notes on the sheet
- А(1,2)
- RIGHT MOTOR MOSFET'S
- LEFT MOTOR MOSFET'S
- Подп. и дата
- Инв. № дубл.
- Взам. инв. №
- Инв. № подл.
- Лист
- Изм
- № докум.
- Подп.
- Дата
- Копировал
- Формат А3
- (in symbol DJ617-6.3 (TA-MR1)) Цепь

### Library data of the parts
C27-C32 C39-C44 = Ceramic_0603: ValueManufacturerPartNumber: Ceramic capacitor, 2.2n, X7R, ±10%, 100V, 0603, -55...+125°C; TypeCapacitor: Ceramic capacitor; Tolerance: ±10%; TypeDielectric: X7R; Package: 0603; Temperature: -55...+125°C
C33-C35 C45-C47 = Ceramic_1206: ValueManufacturerPartNumber: Ceramic capacitor, 1μ, X7R, ±10%, 100V, 1206, -55...+125°C; TypeCapacitor: Ceramic capacitor; Tolerance: ±10%; TypeDielectric: X7R; Package: 1206; Temperature: -55...+125°C
C36-C38 C48-C50 = ECR1021: PartNumber: B45196HM20-35 B-100u мкФ; Value: 100u; Type: ECR1021
NT1-NT6 = NT
R17-R22 R38-R43 = RES 0402: PartNumber: RC0402FR-071KL; Tolerance: 1%; Value: 10; Manufacturer: *; Type: Resistor; Temperature_Range: *; Composition: *; Voltage: *; Case: 0402
R23-R28 R44-R49 = RES 0402: Tolerance: 1%; PartNumber: *; Value: 10k
R29-R34 R50-R55 = RES 0805: Tolerance: *; PartNumber: *; Value: 2.7
R35-R37 R56-R58 = RES 2512: PartNumber: CST0612-FC-R001E; Value: 0.001
VT1-VT12 = MOSFET_N_123: Manufacturer: Infineon Technologies; ValueManufacturerPartNumber: MOSFET N-channel transistor, 150V, 35A, 9.1nC, 2.5W, 29mOhm, 756pF, DIRECTFET-MZ, -55...+150°C; PartNumber: IRF6643TRPBF; TypeTransistor: MOSFET N-channel transistor; VoltageDS: 150V; CurrentDS: 35A; RDS: 29mOhm; GateCharge: 9.1nC; InputCapacitor: 756pF; MaxPower: 2.5W; Package: DIRECTFET-MZ; Link: https://www.chipdip.by/product/irf6643trpbf; Temperature: -55...+150°C
X1-X6 = DJ617-6.3 (TA-MR1): PartNumber: DJ617-6.3 (TA-MR1)

## Sheet BLDC-PWR-CONROLLER.SchDoc
size 420 x 297 mm; DocumentNumber: АБВГ.000000.000 Э3; SheetNumber: 4; PageSetup: Record=PageOptions|CenterHorizontal=False|CenterVertical=False|PrintScale=0.95|XCorrection=0.00|YCorrection=0.00|PrintKind=1|BorderSize=5000000|LeftOffset=0|BottomOffset=0|Orientation=1|PaperLength=1000|PaperWidth=1000|Scale=100|PaperSource=15|PrintQuality=600|MediaType=1|DitherType=10|PaperKind=A4|PrintScaleMode=1; Letter1Column: {}; Letter2Column: {}; Letter3Column: {}; ProcessInspection: ProcessInspection; EngineerName: EngineerName; NormInspection: NormInspection; DocumentType: DocumentType; Mass: Mass; Scale: Scale; Developer1size1str: Developer1size1str; Developer2size1str: Developer2size1str; Developer2size2str: Developer2size2str; Title1size1str: Title1size1str; Title2size1str: Title2size1str; Title2size2str: Title2size2str; Title3size3str: Title3size3str; Title3size2str: Title3size2str; Title3size1str: Title3size1str; FunctionalGroup: #_
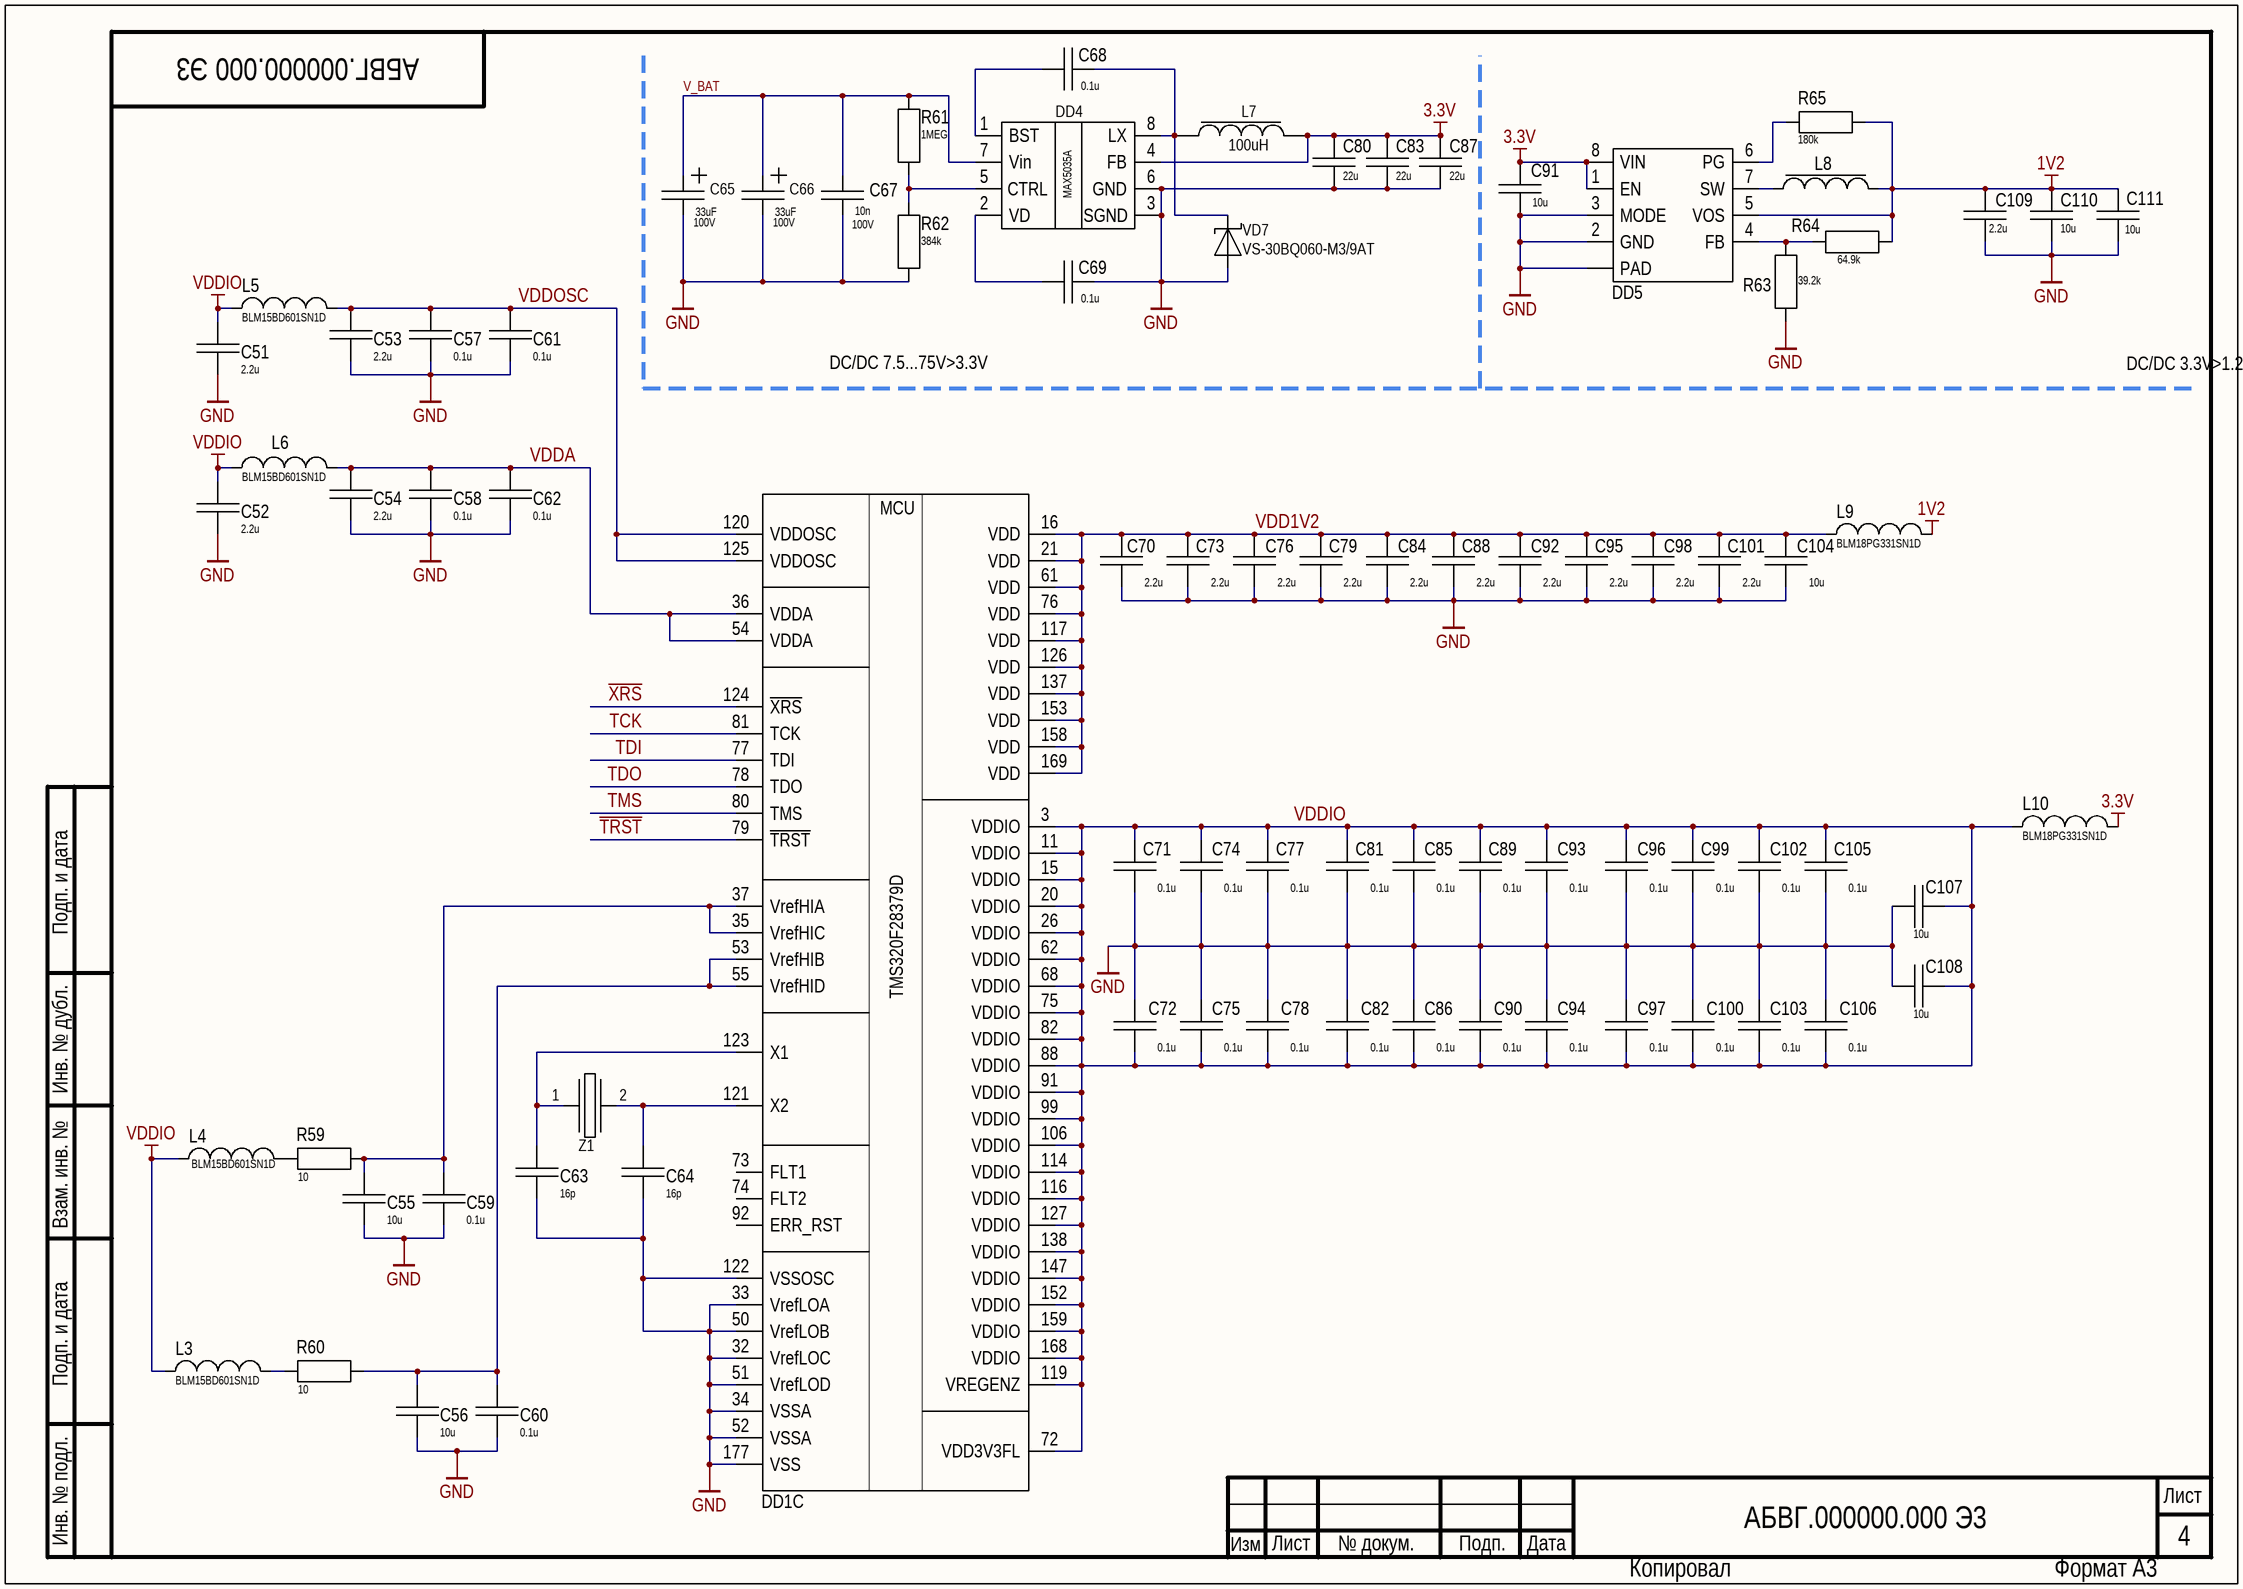
[diagram p3: BLDC-PWR-CONROLLER.SchDoc]

### Parts
C51  2.2u  [CAP: 0402]
C52  2.2u  [CAP: 0402]
C53  2.2u  [CAP: 0402]
C54  2.2u  [CAP: 0402]
C55  10u  [CAP: 0402]
C56  10u  [CAP: 0402]
C57  0.1u  [CAP: 0402]
C58  0.1u  [CAP: 0402]
C59  0.1u  [CAP: 0402]
C60  0.1u  [CAP: 0402]
C61  0.1u  [CAP: 0402]
C62  0.1u  [CAP: 0402]
C63  16p  [CAP: 0402]
C64  16p  [CAP: 0402]
C65  value 33uF  Voltage: 100V  [ECR08]  (hidden comment: ECR0812)
C66  value 33uF  Voltage: 100V  [ECR08]  (hidden comment: ECR0812)
C67  value 10n  Voltage: 100V  [CAP: 0603]
C68  0.1u  [CAP: 0402]
C69  0.1u  [CAP: 0402]
C70  2.2u  [CAP: 0402]
C71  0.1u  [CAP: 0402]
C72  0.1u  [CAP: 0402]
C73  2.2u  [CAP: 0402]
C74  0.1u  [CAP: 0402]
C75  0.1u  [CAP: 0402]
C76  2.2u  [CAP: 0402]
C77  0.1u  [CAP: 0402]
C78  0.1u  [CAP: 0402]
C79  2.2u  [CAP: 0402]
C80  22u  [CAP: 0805]
C81  0.1u  [CAP: 0402]
C82  0.1u  [CAP: 0402]
C83  22u  [CAP: 0805]
C84  2.2u  [CAP: 0402]
C85  0.1u  [CAP: 0402]
C86  0.1u  [CAP: 0402]
C87  22u  [CAP: 0805]
C88  2.2u  [CAP: 0402]
C89  0.1u  [CAP: 0402]
C90  0.1u  [CAP: 0402]
C91  10u  [CAP: 0805]
C92  2.2u  [CAP: 0402]
C93  0.1u  [CAP: 0402]
C94  0.1u  [CAP: 0402]
C95  2.2u  [CAP: 0402]
C96  0.1u  [CAP: 0402]
C97  0.1u  [CAP: 0402]
C98  2.2u  [CAP: 0402]
C99  0.1u  [CAP: 0402]
C100  0.1u  [CAP: 0402]
C101  2.2u  [CAP: 0402]
C102  0.1u  [CAP: 0402]
C103  0.1u  [CAP: 0402]
C104  10u  [CAP: 0402]
C105  0.1u  [CAP: 0402]
C106  0.1u  [CAP: 0402]
C107  10u  [CAP: 0402]
C108  10u  [CAP: 0402]
C109  2.2u  [CAP: 0402]
C110  10u  [CAP: 0805]
C111  10u  [CAP: 0805]
DD1  TMS320F28379DPTP_LACID  [176-HLQFP]  (value not drawn)  (part C of 3)
DD4  MAX5035A  [SOIC-8-150-1.27]
DD5  TPS62080ADSGT  [8-WSON 2.1x2.1]  (value not drawn)
L3  BLM15BD601SN1D  [IND: 0402]
L4  BLM15BD601SN1D  [IND: 0402]
L5  BLM15BD601SN1D  [IND: 0402]
L6  BLM15BD601SN1D  [IND: 0402]
L7  value 100uH  [IND: SRR1208]
L8  LQH3NPN  [IND: LQH3NP]  (value not drawn)
L9  BLM18PG331SN1D  [IND: 0603]
L10  BLM18PG331SN1D  [IND: 0603]
R59  10  [RES: 0402]
R60  10  [RES: 0402]
R61  1MEG  [RES: 0402]
R62  384k  [RES: 0402]
R63  39.2k  [RES: 0402]
R64  64.9k  [RES: 0402]
R65  180k  [RES: 0402]
VD7  PartNumber: VS-30BQ060-M3/9AT  [DIODE: SMC]
Z1  (no value)  [OSC: HC49SM]

### Nets
1V2: C109.2 C110.2 C111.2 DD5.5(VOS) L8.1 L9.2 R64.1 R65.1
3.3V: C80.2 C83.2 C87.2 C91.2 DD4.4(FB) DD5.1(EN) DD5.8(VIN) L7.1 L10.2
GND: C51.1 C52.1 C53.1 C54.1 C55.1 C56.1 C57.1 C58.1 C59.1 C60.1 C61.1 C62.1 C63.1 C64.1 C65.2 C66.2 C67.1 C69.1 C70.1 C71.1 C72.2 C73.1 C74.1 C75.2 C76.1 C77.1 C78.2 C79.1 C80.1 C81.1 C82.2 C83.1 C84.1 C85.1 C86.2 C87.1 C88.1 C89.1 C90.2 C91.1 C92.1 C93.1 C94.2 C95.1 C96.1 C97.2 C98.1 C99.1 C100.2 C101.1 C102.1 C103.2 C104.1 C105.1 C106.2 C107.2 C108.2 C109.1 C110.1 C111.1 DD1.32(VrefLOC) DD1.33(VrefLOA) DD1.34(VSSA) DD1.50(VrefLOB) DD1.51(VrefLOD) DD1.52(VSSA) DD1.122(VSSOSC) DD1.177(VSS) DD4.3(SGND) DD4.6(GND) DD5.0(PAD) DD5.2(GND) DD5.3(MODE) R62.1 R63.1 VD7.1
V_BAT: C65.1 C66.1 C67.2 DD4.7(Vin) R61.2
VDDIO: C51.2 C52.2 C71.2 C72.1 C74.2 C75.1 C77.2 C78.1 C81.2 C82.1 C85.2 C86.1 C89.2 C90.1 C93.2 C94.1 C96.2 C97.1 C99.2 C100.1 C102.2 C103.1 C105.2 C106.1 C107.1 C108.1 DD1.3(VDDIO) DD1.11(VDDIO) DD1.15(VDDIO) DD1.20(VDDIO) DD1.26(VDDIO) DD1.62(VDDIO) DD1.68(VDDIO) DD1.72(VDD3V3FL) DD1.75(VDDIO) DD1.82(VDDIO) DD1.88(VDDIO) DD1.91(VDDIO) DD1.99(VDDIO) DD1.106(VDDIO) DD1.114(VDDIO) DD1.116(VDDIO) DD1.119(VREGENZ) DD1.127(VDDIO) DD1.138(VDDIO) DD1.147(VDDIO) DD1.152(VDDIO) DD1.159(VDDIO) DD1.168(VDDIO) L3.1 L4.1 L5.1 L6.1 L10.1
~{TRST}: DD1.79(~{TRST})
TCK: DD1.81(TCK)
TDI: DD1.77(TDI)
TDO: DD1.78(TDO)
TMS: DD1.80(TMS)
VDD1V2: C70.2 C73.2 C76.2 C79.2 C84.2 C88.2 C92.2 C95.2 C98.2 C101.2 C104.2 DD1.16(VDD) DD1.21(VDD) DD1.61(VDD) DD1.76(VDD) DD1.117(VDD) DD1.126(VDD) DD1.137(VDD) DD1.153(VDD) DD1.158(VDD) DD1.169(VDD) L9.1
VDDA: C54.2 C58.2 C62.2 DD1.36(VDDA) DD1.54(VDDA) L6.2
VDDOSC: C53.2 C57.2 C61.2 DD1.120(VDDOSC) DD1.125(VDDOSC) L5.2
~{XRS}: DD1.124(~{XRS})
NetC55_2: C55.2 C59.2 DD1.35(VrefHIC) DD1.37(VrefHIA) R59.1
NetC56_2: C56.2 C60.2 DD1.53(VrefHIB) DD1.55(VrefHID) R60.1
NetC63_2: C63.2 DD1.123(X1) Z1.1
NetC64_2: C64.2 DD1.121(X2) Z1.2
NetC68_1: C68.1 DD4.8(LX) L7.2 VD7.2
NetC68_2: C68.2 DD4.1(BST)
NetC69_2: C69.2 DD4.2(VD)
NetDD4_5: DD4.5(CTRL) R61.1 R62.2
NetDD5_4: DD5.4(FB) R63.2 R64.2
NetDD5_6: DD5.6(PG) R65.2
NetDD5_7: DD5.7(SW) L8.2
NetL3_2: L3.2 R60.2
NetL4_2: L4.2 R59.2

Not connected (* = marked no-connect by the designer): DD1 73(FLT1) 74(FLT2) 92(ERR_RST)

### Notes on the sheet
- DC/DC 7.5...75V>3.3V
- DC/DC 3.3V>1.2V
- Подп. и дата
- Инв. № дубл.
- Взам. инв. №
- Инв. № подл.
- Лист
- Изм
- № докум.
- Подп.
- Дата
- Копировал
- Формат А3
- (in symbol TMS320F28379DPTP_LACID, part C) MCU; TMS320F28379D

### Library data of the parts
C51-C56 C70 C73 C76 C79 C84 C88 C92 C95 C98 C101 C104 C107-C109 = CAP 0402: PartNumber: CC0402MRX5R5BB106; Voltage: 6.3V
  C51-C54 C70 C73 C76 C79 C84 C88 C92 C95 C98 C101 C109: Value: 2.2u
  C55 C56 C104 C107 C108: Value: 10u
C57-C62 C71 C72 C74 C75 C77 C78 C81 C82 C85 C86 C89 C90 C93 C94 C96 C97 C99 C100 C102 C103 C105 C106 = CAP 0402: as C1 on sheet BLDC-DRIVER; Value: 0.1u; Case: 0402
C63 C64 = CAP 0402: PartNumber: GRM1555C1H160JA01D; Manufacturer: Kemet; Voltage: 50V; Type: Capacitor; Temperature_Range: -55/+85; Tolerance: 10%; Value: 16p; Case: 0402
C65 C66 = ECR0812: PartNumber: JRB2A330M03500800120000B; Case: 8x12; Link: https://www.chipdip.by/product0/9000565862
C67 = Ceramic_0603: Manufacturer: murata; PartNumber: GRM188R72A103KA01D; ValueManufacturerPartNumber: Ceramic capacitor, 10n, X7R, ±10%, 100V, 0603, -55...+125°C; TypeCapacitor: Ceramic capacitor; Tolerance: ±10%; TypeDielectric: X7R; Package: 0603; HelpURL: https://www.chipdip.by/product/grm188r72a103ka01d; Temperature: -55...+125°C
C68 C69 = CAP 0402: Manufacturer: Kemet; Voltage: 100V; Type: Capacitor; Temperature_Range: -55/+85; Tolerance: 10%; Value: 0.1u; Case: 0402
C80 C83 C87 = CAP 0805: PartNumber: GRM21BR60J226M*; Voltage: 6.3V; Value: 22u
C91 C110 C111 = CAP 0805: PartNumber: CC0402MRX5R5BB106; Voltage: 6.3V; Value: 10u
DD1 = TMS320F28379DPTP_LACID: PartNumber: TMS320F28379DPTPT; Case: HLQFP-176
DD4 = MAX5035*
DD5 = TPS62080ADSGT: PartNumber: TPS61023DRLR
L7 = Inductor_SRR1208: Manufacturer: EPCOS; PartNumber: B82477G4104M000; TypeInductor: Fixed inductor; MaxCurrent: 1.7A; Tolerance: 20%; Link: https://www.chipdip.by/product/b82477g4104m; Temperature: -40...+150°C
L8 = LQH3NPN: PartNumber: LQH3NPN1R0NJ0L; Type: Chip Coil; Value: 1uH; Case: 1212; Max DC current: *
R59 R60 = RES 0402: as R17 on sheet BLDC-MOSFET; Value: 10; Manufacturer: *; Type: Resistor; Temperature_Range: *; Composition: *; Voltage: *; Case: 0402
R61-R63 = RES 0402: PartNumber: RC0402FR-1339K2L; Tolerance: 1%; Manufacturer: *; Type: Resistor; Temperature_Range: *; Composition: *; Voltage: *; Case: 0402
  R61: Value: 1MEG
  R62: Value: 384k
  R63: Value: 39.2k
R64 = RES 0402: PartNumber: RC0402FR-1364K9L; Tolerance: 1%; Value: 64.9k; Manufacturer: *; Type: Resistor; Temperature_Range: *; Composition: *; Voltage: *; Case: 0402
R65 = RES 0402: PartNumber: RC0402FR-07180RL; Tolerance: 1%; Value: 180k; Manufacturer: *; Type: Resistor; Temperature_Range: *; Composition: *; Voltage: *; Case: 0402
VD7 = Schottky_single: Manufacturer: Diodes Incorporated; ValueManufacturerPartNumber: Schottky diode, 80V, 500mA, 1V, 15pF, SOD-123, -55...+150°C; TypeDiode: Schottky diode; Voltage: 80V; Current: 500mA; VoltageDrop: 1V; RecoveryTime: 15pF; Package: SOD-123; HelpURL: https://www.digikey.com/product-detail/en/diodes-incorporated/MBR0580S1-7/MBR0580S1-7DICT-ND/5080371; Temperature: -55...+150°C
Z1 = Crystal_HC-49SM: Manufacturer: Epson; PartNumber: FC-135 32.7680KA-A5; ValueManufacturerPartNumber: Crystal, , 12.5pF, ±20ppm, case 3215, -40...+85°C; LoadCapacitance: 12.5pF; Tolerance: ±20ppm; Package: case 3215; HelpURL: https://www.digikey.com/product-detail/en/epson/FC-135-32.7680KA-A5/SER4103CT-ND/6188447; Temperature: -40...+85°C; TypeOscilator: Crystal
L3-L6 = BLM15BD601SN1D: PartNumber: BLM15BD601SN1D
L9 L10 = BLM18PG331SN1D: PartNumber: BLM18PG331SN1D

## Sheet BLDC-CONNECTORS.SchDoc
size 594 x 420 mm; DocumentNumber: АБВГ.000000.000 Э3; SheetNumber: 5; PageSetup: Record=PageOptions|CenterHorizontal=False|CenterVertical=False|PrintScale=0.95|XCorrection=0.00|YCorrection=0.00|PrintKind=1|BorderSize=5000000|LeftOffset=0|BottomOffset=0|Orientation=1|PaperLength=1000|PaperWidth=1000|Scale=100|PaperSource=15|PrintQuality=600|MediaType=1|DitherType=10|PaperKind=A4|PrintScaleMode=1; Letter1Column: {}; Letter2Column: {}; Letter3Column: {}; ProcessInspection: ProcessInspection; EngineerName: EngineerName; NormInspection: NormInspection; DocumentType: DocumentType; Mass: Mass; Scale: Scale; Developer1size1str: Developer1size1str; Developer2size1str: Developer2size1str; Developer2size2str: Developer2size2str; Title1size1str: Title1size1str; Title2size1str: Title2size1str; Title2size2str: Title2size2str; Title3size3str: Title3size3str; Title3size2str: Title3size2str; Title3size1str: Title3size1str; FunctionalGroup: #_
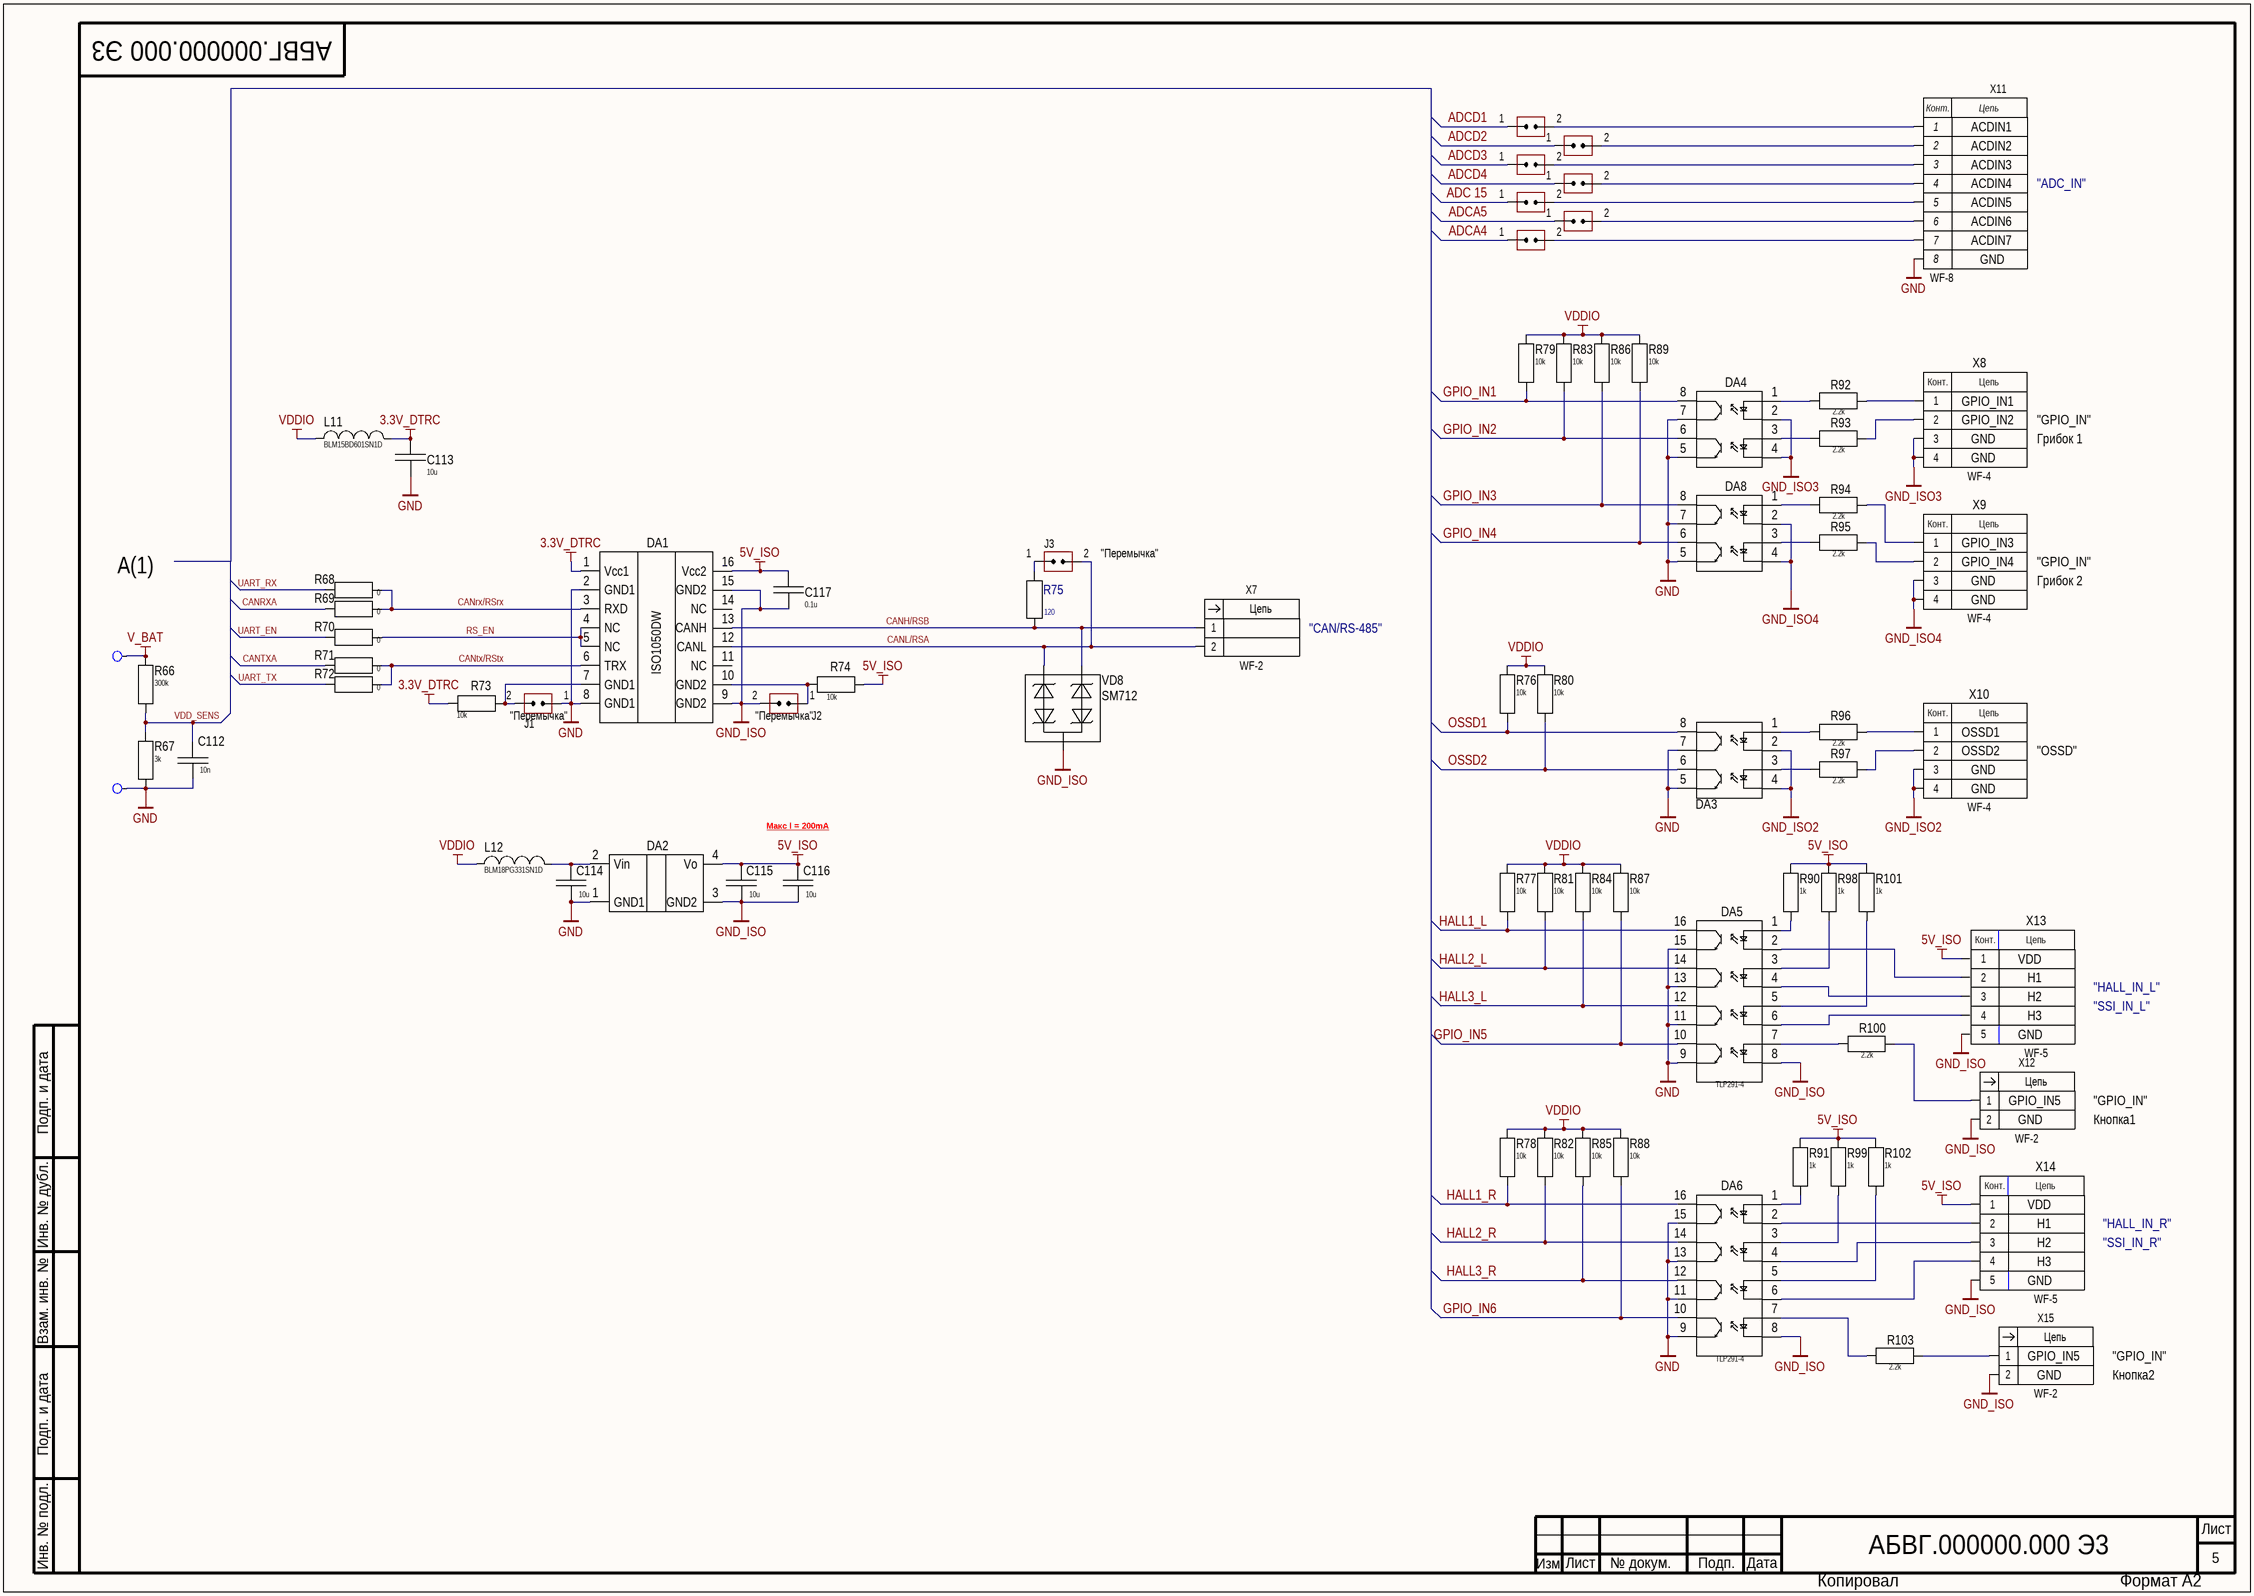
[diagram p4: BLDC-CONNECTORS.SchDoc]

### Parts
C112  10n  [CAP: 0402]
C113  10u  [CAP: 0402]
C114  10u  [CAP: 0402]
C115  10u  [CAP: 0402]
C116  10u  [CAP: 0402]
C117  0.1u  [CAP: 0402]
DA1  ISO1050DW  [SOIC-16-300-1.27]
DA2  ROE-3.305S  [ROE-3.305S]  (value not drawn)
DA3  MOCD207R2M  [8-SOIC]  (value not drawn)
DA4  MOCD207R2M  [8-SOIC]  (value not drawn)
DA5  TLP291-4  [16-SO]
DA6  TLP291-4  [16-SO]
DA8  MOCD207R2M  [8-SOIC]  (value not drawn)
J1  CommentText: "Перемычка"  [CON: JUMPER x1]
J2  CommentText: "Перемычка"  [CON: JUMPER x1]
J3  CommentText: "Перемычка"  [CON: JUMPER x1]
J4  (no value)  [CON: JUMPER x1]
J5  (no value)  [CON: JUMPER x1]
J6  (no value)  [CON: JUMPER x1]
J7  (no value)  [CON: JUMPER x1]
J8  (no value)  [CON: JUMPER x1]
J9  (no value)  [CON: JUMPER x1]
J10  (no value)  [CON: JUMPER x1]
L11  BLM15BD601SN1D  [IND: 0402]
L12  BLM18PG331SN1D  [IND: 0603]
R66  300k  [RES: 0402]
R67  3k  [RES: 0402]
R68  0  [RES: 0402]
R69  0  [RES: 0402]
R70  0  [RES: 0402]
R71  0  [RES: 0402]
R72  0  [RES: 0402]
R73  10k  [RES: 0402]
R74  10k  [RES: 0402]
R75  120  [RES: 0603]
R76  10k  [RES: 0402]
R77  10k  [RES: 0402]
R78  10k  [RES: 0402]
R79  10k  [RES: 0402]
R80  10k  [RES: 0402]
R81  10k  [RES: 0402]
R82  10k  [RES: 0402]
R83  10k  [RES: 0402]
R84  10k  [RES: 0402]
R85  10k  [RES: 0402]
R86  10k  [RES: 0402]
R87  10k  [RES: 0402]
R88  10k  [RES: 0402]
R89  10k  [RES: 0402]
R90  1k  [RES: 0402]
R91  1k  [RES: 0402]
R92  2.2k  [RES: 0402]
R93  2.2k  [RES: 0402]
R94  2.2k  [RES: 0402]
R95  2.2k  [RES: 0402]
R96  2.2k  [RES: 0402]
R97  2.2k  [RES: 0402]
R98  1k  [RES: 0402]
R99  1k  [RES: 0402]
R100  2.2k  [RES: 0402]
R101  1k  [RES: 0402]
R102  1k  [RES: 0402]
R103  2.2k  [RES: 0402]
T1  TestPoint PWR  [CON: DJ617-6.3 (TA-MR1)]  (value not drawn)
T2  TestPoint PWR  [CON: DJ617-6.3 (TA-MR1)]  (value not drawn)
VD8  SM712  [SOT-23-3]
X7  WF-2  [WF-2]
X8  WF-4  [WF-4]
X9  WF-4  [WF-4]
X10  WF-4  [WF-4]
X11  WF-8  [WF-8]
X12  WF-2  [WF-2]
X13  WF-5  [WF-5]
X14  WF-5  [WF-5]
X15  WF-2  [WF-2]

### Nets
3.3V_DTRC: C113.2 DA1.1(Vcc1) L11.1 R73.1
5V_ISO: C115.2 C116.2 C117.2 DA1.16(Vcc2) DA2.4(Vo) R74.2 R90.1 R91.1 R98.1 R99.1 R101.1 R102.1 X13.1 X14.1
GND: C112.1 C113.1 C114.1 DA1.2(GND1) DA1.8(GND1) DA2.1(GND1) DA3.5(Vo1) DA3.7(Vo1) DA4.5(Vo1) DA4.7(Vo1) DA5.9(Vo1) DA5.11(Vo1) DA5.13(Vo1) DA5.15(Vo1) DA6.9(Vo1) DA6.11(Vo1) DA6.13(Vo1) DA6.15(Vo1) DA8.5(Vo1) DA8.7(Vo1) J1.1(IN) R67.2 T2.1(T) X11.8
GND_ISO: C115.1 C116.1 C117.1 DA1.9(GND2) DA1.15(GND2) DA2.3(GND2) DA5.8(C1) DA6.8(C1) J2.2(IN) VD8.3 X12.2 X13.5 X14.5 X15.2
GND_ISO2: DA3.2(C1) DA3.4(C1) X10.3 X10.4
GND_ISO3: DA4.2(C1) DA4.4(C1) X8.3 X8.4
GND_ISO4: DA8.2(C1) DA8.4(C1) X9.3 X9.4
V_BAT: R66.1 T1.1(T)
VDDIO: L11.2 L12.1 R76.1 R77.1 R78.1 R79.1 R80.1 R81.1 R82.1 R83.1 R84.1 R85.1 R86.1 R87.1 R88.1 R89.1
ADC 15: J6.1(IN)
ADCA4: J7.1(IN)
ADCA5: J10.1(IN)
ADCD1: J4.1(IN)
ADCD2: J8.1(IN)
ADCD3: J5.1(IN)
ADCD4: J9.1(IN)
CANH/RSB: DA1.13(CANH) R75.1 VD8.1 X7.1
CANL/RSA: DA1.12(CANL) J3.2(IN) VD8.2 X7.2
CANrx/RSrx: DA1.3(RXD) R68.2 R69.2
CANRXA: R69.1
CANtx/RStx: DA1.6(TRX) R71.2 R72.2
CANTXA: R71.1
GPIO_IN1: DA4.8(Vdd) R79.2
GPIO_IN2: DA4.6(Vdd) R83.2
GPIO_IN3: DA8.8(Vdd) R86.2
GPIO_IN4: DA8.6(Vdd) R89.2
GPIO_IN5: DA5.10(Vdd) R87.2
GPIO_IN6: DA6.10(Vdd) R88.2
HALL1_L: DA5.16(Vdd) R77.2
HALL1_R: DA6.16(Vdd) R78.2
HALL2_L: DA5.14(Vdd) R81.2
HALL2_R: DA6.14(Vdd) R82.2
HALL3_L: DA5.12(Vdd) R84.2
HALL3_R: DA6.12(Vdd) R85.2
OSSD1: DA3.8(Vdd) R76.2
OSSD2: DA3.6(Vdd) R80.2
RS_EN: DA1.4(NC) DA1.5(NC) R70.2
UART_EN: R70.1
UART_RX: R68.1
UART_TX: R72.1
VDD_SENS: C112.2 R66.2 R67.1
NetC114_2: C114.2 DA2.2(Vin) L12.2
NetDA1_7: DA1.7(GND1) J1.2(IN) R73.2
NetDA1_10: DA1.10(GND2) J2.1(IN) R74.1
NetDA3_1: DA3.1(A1) R96.1
NetDA3_3: DA3.3(A1) R97.1
NetDA4_1: DA4.1(A1) R92.1
NetDA4_3: DA4.3(A1) R93.1
NetDA5_1: DA5.1(A1) R90.2
NetDA5_2: DA5.2(C1) X13.2
NetDA5_3: DA5.3(A1) R98.2
NetDA5_4: DA5.4(C1) X13.3
NetDA5_5: DA5.5(A1) R101.2
NetDA5_6: DA5.6(C1) X13.4
NetDA5_7: DA5.7(A1) R100.1
NetDA6_1: DA6.1(A1) R91.2
NetDA6_2: DA6.2(C1) X14.2
NetDA6_3: DA6.3(A1) R99.2
NetDA6_4: DA6.4(C1) X14.3
NetDA6_5: DA6.5(A1) R102.2
NetDA6_6: DA6.6(C1) X14.4
NetDA6_7: DA6.7(A1) R103.1
NetDA8_1: DA8.1(A1) R94.1
NetDA8_3: DA8.3(A1) R95.1
NetJ3_1: J3.1(IN) R75.2
NetJ4_2: J4.2(IN) X11.1
NetJ5_2: J5.2(IN) X11.3
NetJ6_2: J6.2(IN) X11.5
NetJ7_2: J7.2(IN) X11.7
NetJ8_2: J8.2(IN) X11.2
NetJ9_2: J9.2(IN) X11.4
NetJ10_2: J10.2(IN) X11.6
NetR92_2: R92.2 X8.1
NetR93_2: R93.2 X8.2
NetR94_2: R94.2 X9.1
NetR95_2: R95.2 X9.2
NetR96_2: R96.2 X10.1
NetR97_2: R97.2 X10.2
NetR100_2: R100.2 X12.1
NetR103_2: R103.2 X15.1

Not connected (* = marked no-connect by the designer): DA1 11(NC) 14(NC)

### Notes on the sheet
- ACDIN3
- ACDIN2
- ACDIN1
- ACDIN5
- ACDIN4
- "ADC_IN"
- ACDIN7
- ACDIN6
- GND
- (near X8) GPIO_IN1
- (near X8) GPIO_IN2
- "GPIO_IN"
- Грибок 1
- (near X9) GPIO_IN3
- А(1)
- (near X9) GPIO_IN4
- Грибок 2
- "CAN/RS-485"
- (near X10) OSSD1
- (near X10) OSSD2
- "OSSD"
- Макс I = 200mA
- VDD
- H1
- H2
- H3
- "HALL_IN_L"
- "SSI_IN_L"
- (near X12) GPIO_IN5
- Кнопка1
- "HALL_IN_R"
- "SSI_IN_R"
- (near X15) GPIO_IN5
- Кнопка2
- Подп. и дата
- Инв. № дубл.
- Взам. инв. №
- Инв. № подл.
- Лист
- Изм
- № докум.
- Подп.
- Дата
- Копировал
- Формат А2
- (in symbol WF-2) Цепь
- (in symbol WF-4_T) Конт.; Цепь
- (in symbol WF-5) Конт.; Цепь
- (in symbol WF-8) Конт.; Цепь

### Library data of the parts
C112 C117 = CAP 0402: as C1 on sheet BLDC-DRIVER; Case: 0402
  C112: Value: 10n
  C117: Value: 0.1u
C113-C116 = CAP 0402: as C51 on sheet BLDC-PWR-CONROLLER; Value: 10u
DA1 = ISO1050DW: Isolated CAN Trcvr 5kV RMS; PartNumber: ISO1050DW
DA2 = ROE-3.305S: Isol DC/DC 3 to 5V 0.2A; PartNumber: TSR 1; Vin: *
DA5 DA6 = TLP291-4(GB.E): PartNumber: TLP291-4(GB.E)
J1-J3 = Jumper_single
J4-J10 = Jumper_single: CommentText: "Перемычка"
R66-R74 R76-R103 = RES 0402: Tolerance: 1%; PartNumber: *
  R66: Value: 300k
  R67: Value: 3k
  R68-R72: Value: 0
  R73 R74 R76-R89: Value: 10k
  R90 R91 R98 R99 R101 R102: Value: 1k
  R92-R97 R100 R103: Value: 2.2k
R75 = RES 0603: PartNumber: CRCW0603120RFKEAHP; Value: 120
VD8 = SM712: PartNumber: SM712-02HTG
X7 X12 X15 = WF-2: PartNumber: Вилка WF-2 «Zhenqin»; Value: *
X8-X10 = WF-4_T: Value: *
X11 = WF-8: PartNumber: Вилка WF-8 «Zhenqin»; Value: *
X13 X14 = WF-5: PartNumber: Вилка WF-5 «Zhenqin»; Value: *
DA3 DA4 DA8 = MOCD207R2M: PartNumber: MOCD207R2M
L11 = BLM15BD601SN1D: PartNumber: BLM15BD601SN1D
L12 = BLM18PG331SN1D: PartNumber: BLM18PG331SN1D

## Sheet BLDC-FTDI.SchDoc
size 420 x 297 mm; ApprovedBy: Чистов; CheckedBy: Карасюк; DrawnBy: Войтенко; DocumentNumber: 321-720900.300 Э3; SheetNumber: 1; SheetTotal: 3; PageSetup: Record=PageOptions|CenterHorizontal=False|CenterVertical=False|PrintScale=0.95|XCorrection=0.00|YCorrection=0.00|PrintKind=1|BorderSize=5000000|LeftOffset=0|BottomOffset=0|Orientation=1|PaperLength=1000|PaperWidth=1000|Scale=100|PaperSource=15|PrintQuality=600|MediaType=1|DitherType=10|PaperKind=A4|PrintScaleMode=1; Letter1Column: Т; ProcessInspection: .; EngineerName: Чирун; NormInspection: Кузьма; DocumentType: Схема электрическая принципиальная; Developer1size1str: НТПЦ "Белкоммунмаш"; Title1size1str: Плата переферии
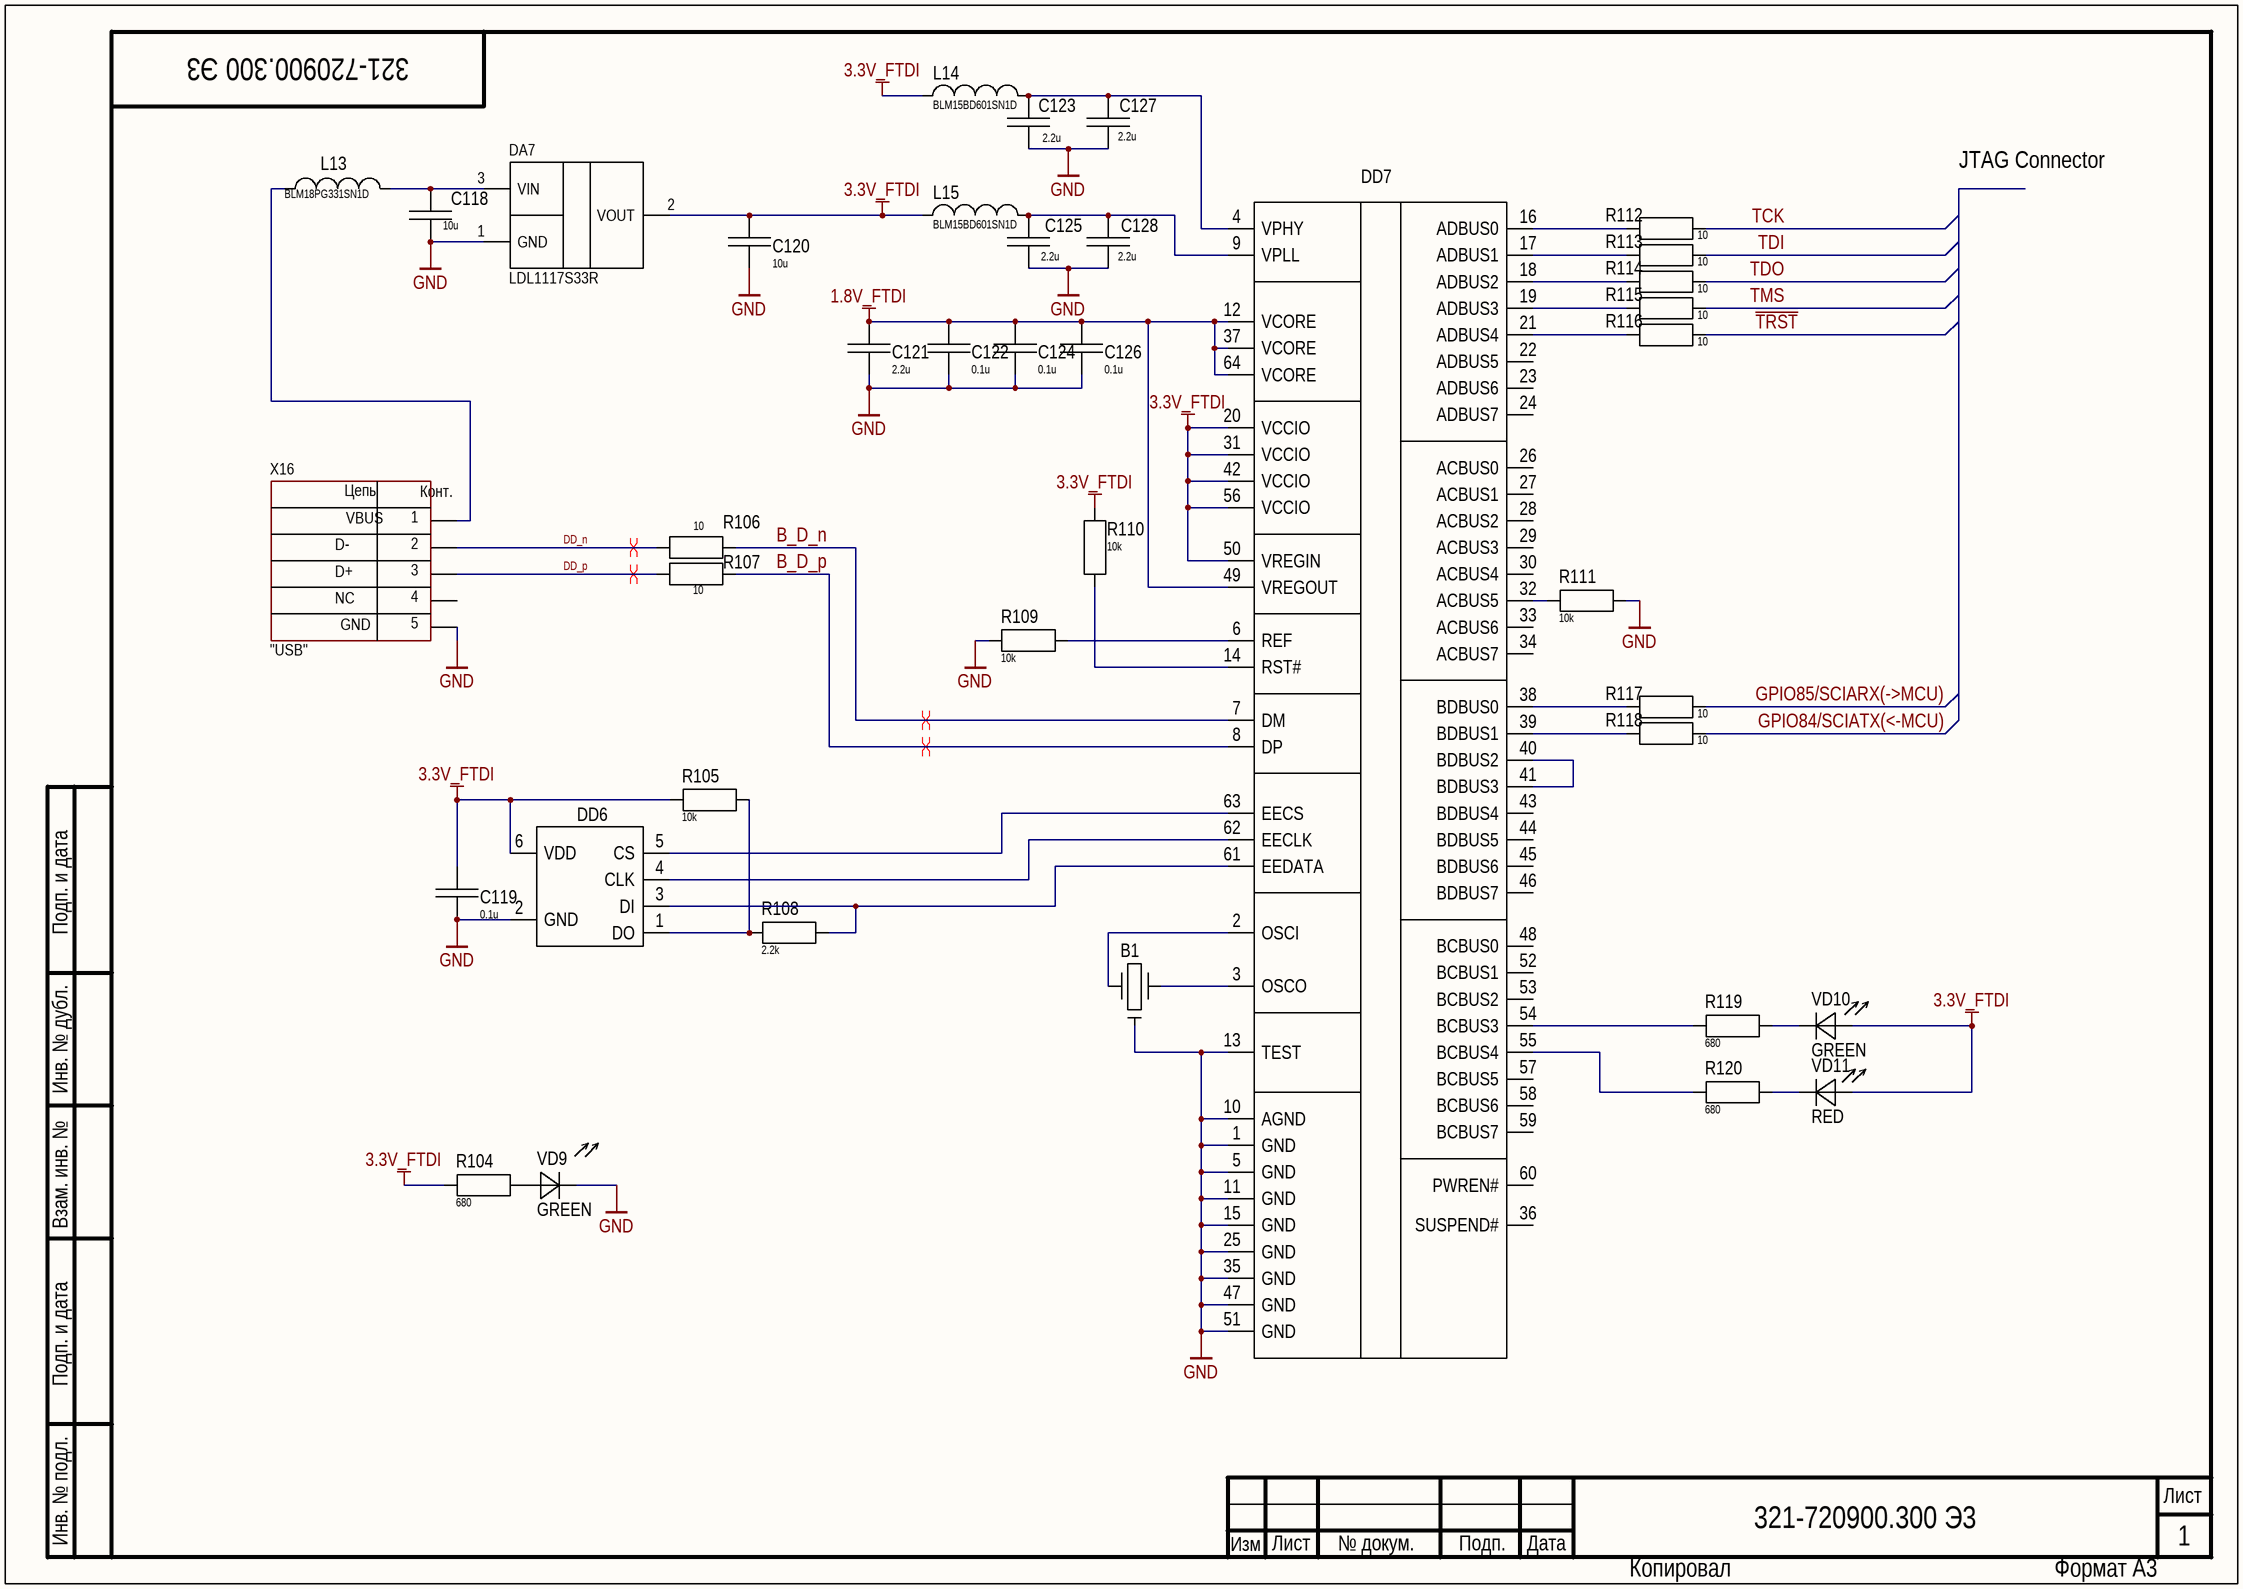
[diagram p5: BLDC-FTDI.SchDoc]

### Parts
B1  CSTCE12M0G52-R0  [OSC: CSTCE]  (value not drawn)
C118  10u  [CAP: 0805]
C119  0.1u  [CAP: 0402]
C120  10u  [CAP: 0805]
C121  2.2u  [CAP: 0402]
C122  0.1u  [CAP: 0402]
C123  2.2u  [CAP: 0402]
C124  0.1u  [CAP: 0402]
C125  2.2u  [CAP: 0402]
C126  0.1u  [CAP: 0402]
C127  2.2u  [CAP: 0402]
C128  2.2u  [CAP: 0402]
DA7  (no value)  [SOT223]
DD6  93LC56BT-I/OT  [SOT23-6]  (value not drawn)
DD7  FT2232HL  [64-LQFP]  (value not drawn)
L13  BLM18PG331SN1D  [IND: 0603]
L14  BLM15BD601SN1D  [IND: 0402]
L15  BLM15BD601SN1D  [IND: 0402]
R104  680  [RES: 0402]
R105  10k  [RES: 0402]
R106  10  [RES: 0402]
R107  10  [RES: 0402]
R108  2.2k  [RES: 0402]
R109  10k  [RES: 0402]
R110  10k  [RES: 0402]
R111  10k  [RES: 0402]
R112  10  [RES: 0402]
R113  10  [RES: 0402]
R114  10  [RES: 0402]
R115  10  [RES: 0402]
R116  10  [RES: 0402]
R117  10  [RES: 0402]
R118  10  [RES: 0402]
R119  680  [RES: 0402]
R120  680  [RES: 0402]
VD9  value GREEN  [LED: 0402G]  (hidden comment: Led 0402 GREEN)
VD10  value GREEN  [LED: 0402G]  (hidden comment: Led 0402 GREEN)
VD11  value RED  [LED: 0402R]  (hidden comment: Led 0402 RED)
X16  CommentText: "USB"  [CON: 0675031020]

### Nets
1.8V_FTDI: C121.2 C122.2 C124.2 C126.2 DD7.12(VCORE) DD7.37(VCORE) DD7.49(VREGOUT) DD7.64(VCORE)
3.3V_FTDI: C119.2 C120.2 DA7.2(VOUT) DD6.6(VDD) DD7.20(VCCIO) DD7.31(VCCIO) DD7.42(VCCIO) DD7.50(VREGIN) DD7.56(VCCIO) L14.1 L15.1 R104.2 R105.2 R110.1 VD10.1 VD11.1
GND: B1.2 C118.1 C119.1 C120.1 C121.1 C122.1 C123.1 C124.1 C125.1 C126.1 C127.1 C128.1 DA7.1(GND) DD6.2(GND) DD7.1(GND) DD7.5(GND) DD7.10(AGND) DD7.11(GND) DD7.13(TEST) DD7.15(GND) DD7.25(GND) DD7.35(GND) DD7.47(GND) DD7.51(GND) R109.2 R111.2 VD9.2 X16.5
B_D_n: DD7.7(DM) R106.1
B_D_p: DD7.8(DP) R107.1
DD_n: R106.2 X16.2
DD_p: R107.2 X16.3
GPIO84/SCIATX(<-MCU): R118.1
GPIO85/SCIARX(->MCU): R117.1
~{TRST}: R116.1
TCK: R112.1
TDI: R113.1
TDO: R114.1
TMS: R115.1
NetB1_1: B1.1 DD7.2(OSCI)
NetB1_3: B1.3 DD7.3(OSCO)
NetC118_2: C118.2 DA7.3(VIN) L13.1
NetC123_2: C123.2 C127.2 DD7.4(VPHY) L14.2
NetC125_2: C125.2 C128.2 DD7.9(VPLL) L15.2
NetDD6_1: DD6.1(DO) R105.1 R108.2
NetDD6_3: DD6.3(DI) DD7.61(EEDATA) R108.1
NetDD6_4: DD6.4(CLK) DD7.62(EECLK)
NetDD6_5: DD6.5(CS) DD7.63(EECS)
NetDD7_6: DD7.6(REF) R109.1
NetDD7_14: DD7.14(RST#) R110.2
NetDD7_16: DD7.16(ADBUS0) R112.2
NetDD7_17: DD7.17(ADBUS1) R113.2
NetDD7_18: DD7.18(ADBUS2) R114.2
NetDD7_19: DD7.19(ADBUS3) R115.2
NetDD7_21: DD7.21(ADBUS4) R116.2
NetDD7_32: DD7.32(ACBUS5) R111.1
NetDD7_38: DD7.38(BDBUS0) R117.2
NetDD7_39: DD7.39(BDBUS1) R118.2
NetDD7_40: DD7.40(BDBUS2) DD7.41(BDBUS3)
NetDD7_54: DD7.54(BCBUS3) R119.1
NetDD7_55: DD7.55(BCBUS4) R120.1
NetL13_2: L13.2 X16.1
NetR104_1: R104.1 VD9.1
NetR119_2: R119.2 VD10.2
NetR120_2: R120.2 VD11.2

Not connected (* = marked no-connect by the designer): DD7 22(ADBUS5) 23(ADBUS6) 24(ADBUS7) 26(ACBUS0) 27(ACBUS1) 28(ACBUS2) 29(ACBUS3) 30(ACBUS4) 33(ACBUS6) 34(ACBUS7) 36(SUSPEND#) 43(BDBUS4) 44(BDBUS5) 45(BDBUS6) 46(BDBUS7) 48(BCBUS0) 52(BCBUS1) 53(BCBUS2) 57(BCBUS5) 58(BCBUS6) 59(BCBUS7) 60(PWREN#); X16 4

### Layout directives
differential pair: B_D_n, B_D_p, DD_n, DD_p

### Notes on the sheet
- JTAG Connector
- Подп. и дата
- Инв. № дубл.
- Взам. инв. №
- Инв. № подл.
- Лист
- Изм
- № докум.
- Подп.
- Дата
- Копировал
- Формат А3
- (in symbol Connector_USB_mini_B) Цепь; Конт.; VBUS; D-; D+; NC; GND

### Library data of the parts
B1 = CSTCE12M0G52-R0: Value: 12MHz; Type: Crystal Clock; PartNumber: CSTCE12M0G52-R0
C118 C120 = CAP 0805: as C91 on sheet BLDC-PWR-CONROLLER; Value: 10u
C119 C122 C124 C126 = CAP 0402: as C1 on sheet BLDC-DRIVER; Value: 0.1u; Case: 0402
C121 C123 C125 C127 C128 = CAP 0402: as C51 on sheet BLDC-PWR-CONROLLER; Value: 2.2u
DA7 = LDL1117S33R: Linear voltage regulator; Manufacturer: STMicroelectronics; ValueManufacturerPartNumber: Linear voltage regulator, input 3.9...18V, 0.6V, output 3.3V, 1.2A, -40...+85°C, SOT223; VoltageInput: input 3.9...18V; MaxDropout: 0.6V; CurrentOutput: 1.2A; VoltageOutput: output 3.3V; HelpURL: https://www.digikey.com/product-detail/en/stmicroelectronics/LDL1117S33R/497-17239-1-ND/7102079; Package: SOT223; ComponentType: Linear voltage regulator; Temperature: -40...+85°C; PartNumber: LDL1117S33R
R104 R119 R120 = RES 0402: PartNumber: RC0402FR-07680RL; Value: 680; Case: 0402
R105 R109-R111 = RES 0402: PartNumber: RC0402FR-0710KL; Tolerance: 1%; Value: 10k; Manufacturer: *; Type: Resistor; Temperature_Range: *; Composition: *; Voltage: *; Case: 0402
R106 R107 R112-R118 = RES 0402: PartNumber: RC0402FR-0710RL; Tolerance: 1%; Value: 10; Manufacturer: *; Type: Resistor; Temperature_Range: *; Composition: *; Voltage: *; Case: 0402
R108 = RES 0402: PartNumber: RC0402FR-072K2L; Tolerance: 1%; Value: 2.2k; Manufacturer: *; Type: Resistor; Temperature_Range: *; Composition: *; Voltage: *; Case: 0402
VD9 VD10 = Led 0402 GREEN: PartNumber: SML-P11MTT86R; Case: 0402
VD11 = Led 0402 RED: PartNumber: SML-P11VTT86R; Case: 0402
X16 = Connector_USB_mini_B: Manufacturer: Molex; ValueManufacturerPartNumber: USB mini B; PartNumber: 0675031020; HelpURL: https://www.digikey.com/product-detail/en/molex/0675031020/WM5461CT-ND/1624427; TypeConnector: USB mini B
DD6 = 93LC56BT-I/OT: PartNumber: 93LC56BT-I/OT
DD7 = FT2232HL: PartNumber: FT2232HL
L13 = BLM18PG331SN1D: PartNumber: BLM18PG331SN1D
L14 L15 = BLM15BD601SN1D: PartNumber: BLM15BD601SN1D

## Nets that join several sheets
3.3V: BLDC-DRIVER (8 pins), BLDC-PWR-CONROLLER (9 pins)
GND: BLDC-DRIVER (34 pins), BLDC-MOSFET (24 pins), BLDC-PWR-CONROLLER (76 pins), BLDC-CONNECTORS (24 pins), BLDC-FTDI (28 pins)
V_BAT: BLDC-DRIVER (12 pins), BLDC-MOSFET (24 pins), BLDC-PWR-CONROLLER (5 pins), BLDC-CONNECTORS (R66.1 T1.1)
VDDIO: BLDC-CONTROLLET (VD12.1 VD13.1 VD14.1 VD15.1), BLDC-PWR-CONROLLER (54 pins), BLDC-CONNECTORS (16 pins)
ADC 15: BLDC-CONTROLLET (DD1.46), BLDC-CONNECTORS (J6.1)
ADCA4: BLDC-CONTROLLET (DD1.44), BLDC-CONNECTORS (J7.1)
ADCA5: BLDC-CONTROLLET (DD1.43), BLDC-CONNECTORS (J10.1)
ADCD1: BLDC-CONTROLLET (DD1.57), BLDC-CONNECTORS (J4.1)
ADCD2: BLDC-CONTROLLET (DD1.58), BLDC-CONNECTORS (J8.1)
ADCD3: BLDC-CONTROLLET (DD1.49), BLDC-CONNECTORS (J5.1)
ADCD4: BLDC-CONTROLLET (DD1.45), BLDC-CONNECTORS (J9.1)
CANRXA: BLDC-CONTROLLET (DD1.63), BLDC-CONNECTORS (R69.1)
CANTXA: BLDC-CONTROLLET (DD1.66), BLDC-CONNECTORS (R71.1)
ENABLE_L: BLDC-CONTROLLET (DD1.70), BLDC-DRIVER (DD2.33)
ENABLE_R: BLDC-CONTROLLET (DD1.113), BLDC-DRIVER (DD3.33)
FLT_L: BLDC-CONTROLLET (DD1.69), BLDC-DRIVER (DD2.28 R1.1 R2.1)
FLT_R: BLDC-CONTROLLET (DD1.67), BLDC-DRIVER (DD3.28 R9.1 R10.1)
GHA_L: BLDC-DRIVER (DD2.8), BLDC-MOSFET (R17.2)
GHA_R: BLDC-DRIVER (DD3.8), BLDC-MOSFET (R38.2)
GHB_L: BLDC-DRIVER (DD2.17), BLDC-MOSFET (R19.2)
GHB_R: BLDC-DRIVER (DD3.17), BLDC-MOSFET (R40.2)
GHC_L: BLDC-DRIVER (DD2.18), BLDC-MOSFET (R21.2)
GHC_R: BLDC-DRIVER (DD3.18), BLDC-MOSFET (R42.2)
GLA_L: BLDC-DRIVER (DD2.10), BLDC-MOSFET (R18.2)
GLA_R: BLDC-DRIVER (DD3.10), BLDC-MOSFET (R39.2)
GLB_L: BLDC-DRIVER (DD2.15), BLDC-MOSFET (R20.2)
GLB_R: BLDC-DRIVER (DD3.15), BLDC-MOSFET (R41.2)
GLC_L: BLDC-DRIVER (DD2.20), BLDC-MOSFET (R22.2)
GLC_R: BLDC-DRIVER (DD3.20), BLDC-MOSFET (R43.2)
GPIO84/SCIATX(<-MCU): BLDC-CONTROLLET (DD1.154), BLDC-FTDI (R118.1)
GPIO85/SCIARX(->MCU): BLDC-CONTROLLET (DD1.155), BLDC-FTDI (R117.1)
GPIO_IN1: BLDC-CONTROLLET (DD1.71), BLDC-CONNECTORS (DA4.8 R79.2)
GPIO_IN2: BLDC-CONTROLLET (DD1.65), BLDC-CONNECTORS (DA4.6 R83.2)
GPIO_IN3: BLDC-CONTROLLET (DD1.85), BLDC-CONNECTORS (DA8.8 R86.2)
GPIO_IN4: BLDC-CONTROLLET (DD1.87), BLDC-CONNECTORS (DA8.6 R89.2)
GPIO_IN5: BLDC-CONTROLLET (DD1.19), BLDC-CONNECTORS (DA5.10 R87.2)
GPIO_IN6: BLDC-CONTROLLET (DD1.166), BLDC-CONNECTORS (DA6.10 R88.2)
HALL1_L: BLDC-CONTROLLET (DD1.24), BLDC-CONNECTORS (DA5.16 R77.2)
HALL1_R: BLDC-CONTROLLET (DD1.13), BLDC-CONNECTORS (DA6.16 R78.2)
HALL2_L: BLDC-CONTROLLET (DD1.25), BLDC-CONNECTORS (DA5.14 R81.2)
HALL2_R: BLDC-CONTROLLET (DD1.14), BLDC-CONNECTORS (DA6.14 R82.2)
HALL3_L: BLDC-CONTROLLET (DD1.27), BLDC-CONNECTORS (DA5.12 R84.2)
HALL3_R: BLDC-CONTROLLET (DD1.23), BLDC-CONNECTORS (DA6.12 R85.2)
INHA_L: BLDC-CONTROLLET (DD1.1), BLDC-DRIVER (DD2.34)
INHA_R: BLDC-CONTROLLET (DD1.160), BLDC-DRIVER (DD3.34)
INHB_L: BLDC-CONTROLLET (DD1.4), BLDC-DRIVER (DD2.36)
INHB_R: BLDC-CONTROLLET (DD1.162), BLDC-DRIVER (DD3.36)
INHC_L: BLDC-CONTROLLET (DD1.6), BLDC-DRIVER (DD2.38)
INHC_R: BLDC-CONTROLLET (DD1.164), BLDC-DRIVER (DD3.38)
INLA_L: BLDC-CONTROLLET (DD1.2), BLDC-DRIVER (DD2.35)
INLA_R: BLDC-CONTROLLET (DD1.161), BLDC-DRIVER (DD3.35)
INLB_L: BLDC-CONTROLLET (DD1.5), BLDC-DRIVER (DD2.37)
INLB_R: BLDC-CONTROLLET (DD1.163), BLDC-DRIVER (DD3.37)
INLC_L: BLDC-CONTROLLET (DD1.7), BLDC-DRIVER (DD2.39)
INLC_R: BLDC-CONTROLLET (DD1.165), BLDC-DRIVER (DD3.39)
nSCS_L: BLDC-CONTROLLET (DD1.105), BLDC-DRIVER (DD2.32)
nSCS_R: BLDC-CONTROLLET (DD1.112), BLDC-DRIVER (DD3.32)
OSSD1: BLDC-CONTROLLET (DD1.9), BLDC-CONNECTORS (DA3.8 R76.2)
OSSD2: BLDC-CONTROLLET (DD1.8), BLDC-CONNECTORS (DA3.6 R80.2)
OUTA_L: BLDC-DRIVER (DD2.9), BLDC-MOSFET (6 pins)
OUTA_R: BLDC-DRIVER (DD3.9), BLDC-MOSFET (6 pins)
OUTB_L: BLDC-DRIVER (DD2.16), BLDC-MOSFET (6 pins)
OUTB_R: BLDC-DRIVER (DD3.16), BLDC-MOSFET (6 pins)
OUTC_L: BLDC-DRIVER (DD2.19), BLDC-MOSFET (6 pins)
OUTC_R: BLDC-DRIVER (DD3.19), BLDC-MOSFET (6 pins)
SCLK: BLDC-CONTROLLET (DD1.107), BLDC-DRIVER (DD2.31 DD3.31)
SDI: BLDC-CONTROLLET (DD1.104), BLDC-DRIVER (DD2.30 DD3.30)
SDO: BLDC-CONTROLLET (DD1.103), BLDC-DRIVER (DD2.29 DD3.29)
SNA_L: BLDC-DRIVER (DD2.12), BLDC-MOSFET (NT3.2)
SNA_R: BLDC-DRIVER (DD3.12), BLDC-MOSFET (NT4.2)
SNB_L: BLDC-DRIVER (DD2.13), BLDC-MOSFET (NT1.2)
SNB_R: BLDC-DRIVER (DD3.13), BLDC-MOSFET (NT5.2)
SNC_L: BLDC-DRIVER (DD2.22), BLDC-MOSFET (NT2.2)
SNC_R: BLDC-DRIVER (DD3.22), BLDC-MOSFET (NT6.2)
SOA_L: BLDC-CONTROLLET (DD1.31), BLDC-DRIVER (DD2.25)
SOA_R: BLDC-CONTROLLET (DD1.29), BLDC-DRIVER (DD3.25)
SOB_L: BLDC-CONTROLLET (DD1.48), BLDC-DRIVER (DD2.24)
SOB_R: BLDC-CONTROLLET (DD1.47), BLDC-DRIVER (DD3.24)
SOC_L: BLDC-CONTROLLET (DD1.41), BLDC-DRIVER (DD2.23)
SOC_R: BLDC-CONTROLLET (DD1.42), BLDC-DRIVER (DD3.23)
SPA_L: BLDC-DRIVER (DD2.11), BLDC-MOSFET (C28.1 R24.1 R37.2 VT2.3)
SPA_R: BLDC-DRIVER (DD3.11), BLDC-MOSFET (C40.1 R45.1 R56.2 VT8.3)
SPB_L: BLDC-DRIVER (DD2.14), BLDC-MOSFET (C30.1 R26.1 R35.2 VT4.3)
SPB_R: BLDC-DRIVER (DD3.14), BLDC-MOSFET (C42.1 R47.1 R57.2 VT10.3)
SPC_L: BLDC-DRIVER (DD2.21), BLDC-MOSFET (C32.1 R28.1 R36.2 VT6.3)
SPC_R: BLDC-DRIVER (DD3.21), BLDC-MOSFET (C44.1 R49.1 R58.2 VT12.3)
~{TRST}: BLDC-PWR-CONROLLER (DD1.79), BLDC-FTDI (R116.1)
TCK: BLDC-PWR-CONROLLER (DD1.81), BLDC-FTDI (R112.1)
TDI: BLDC-PWR-CONROLLER (DD1.77), BLDC-FTDI (R113.1)
TDO: BLDC-PWR-CONROLLER (DD1.78), BLDC-FTDI (R114.1)
TMS: BLDC-PWR-CONROLLER (DD1.80), BLDC-FTDI (R115.1)
UART_EN: BLDC-CONTROLLET (DD1.149), BLDC-CONNECTORS (R70.1)
UART_RX: BLDC-CONTROLLET (DD1.157), BLDC-CONNECTORS (R68.1)
UART_TX: BLDC-CONTROLLET (DD1.156), BLDC-CONNECTORS (R72.1)
VDD_SENS: BLDC-CONTROLLET (DD1.40), BLDC-CONNECTORS (C112.2 R66.2 R67.1)